# EAGLE schematic A3660 (EAGLE 8.2.2)

## Sheet 1 of 6
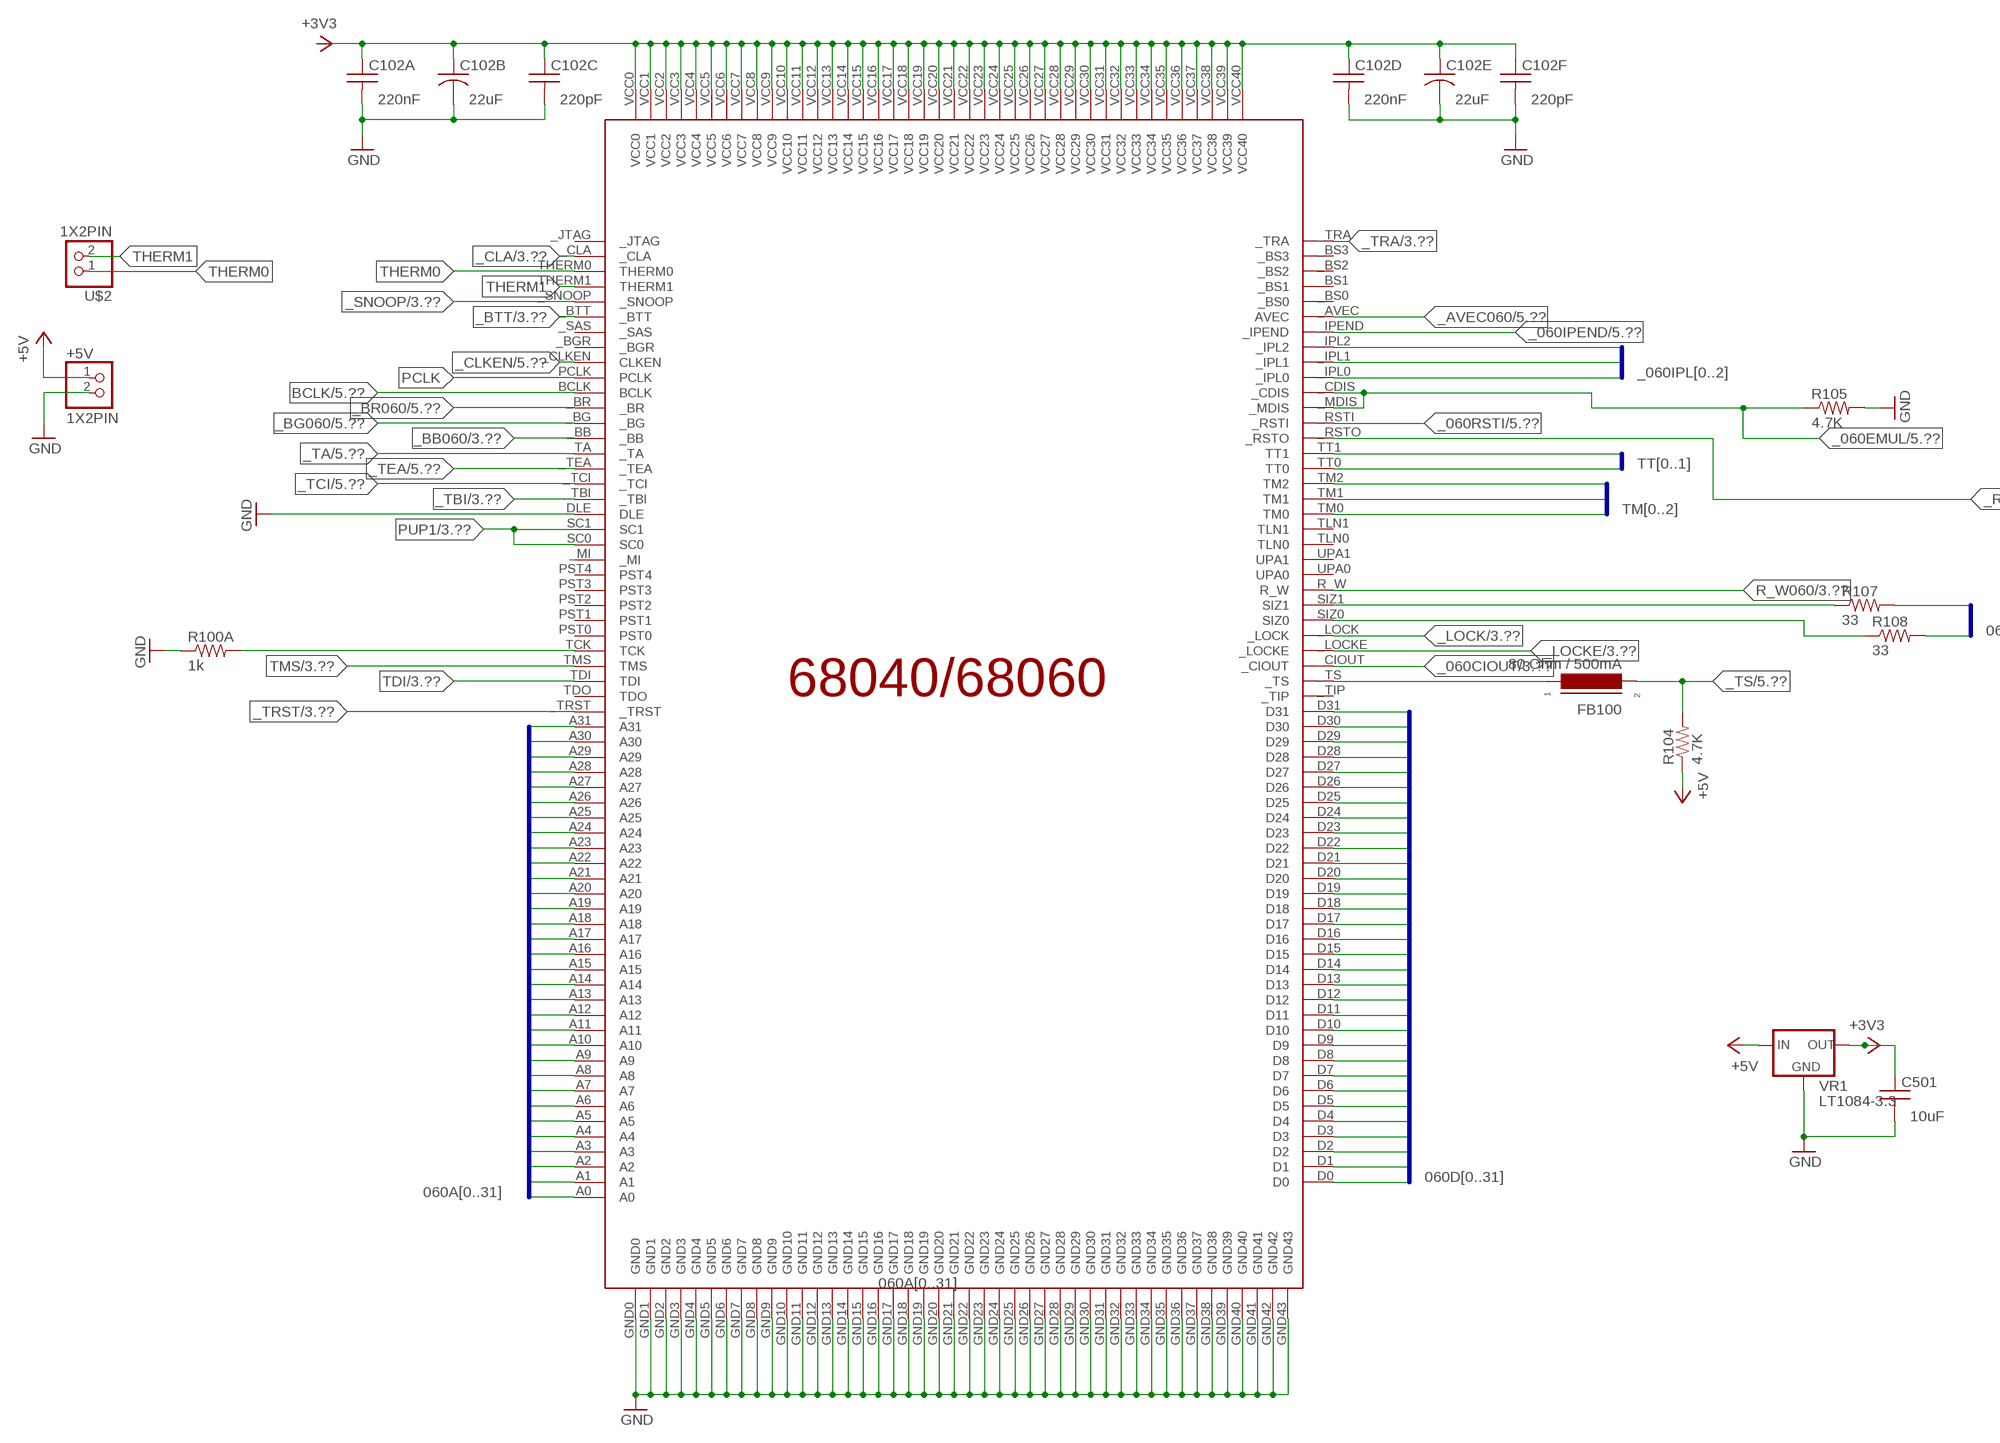
[diagram p0: schematic, sheet 1, part 1 of 2]
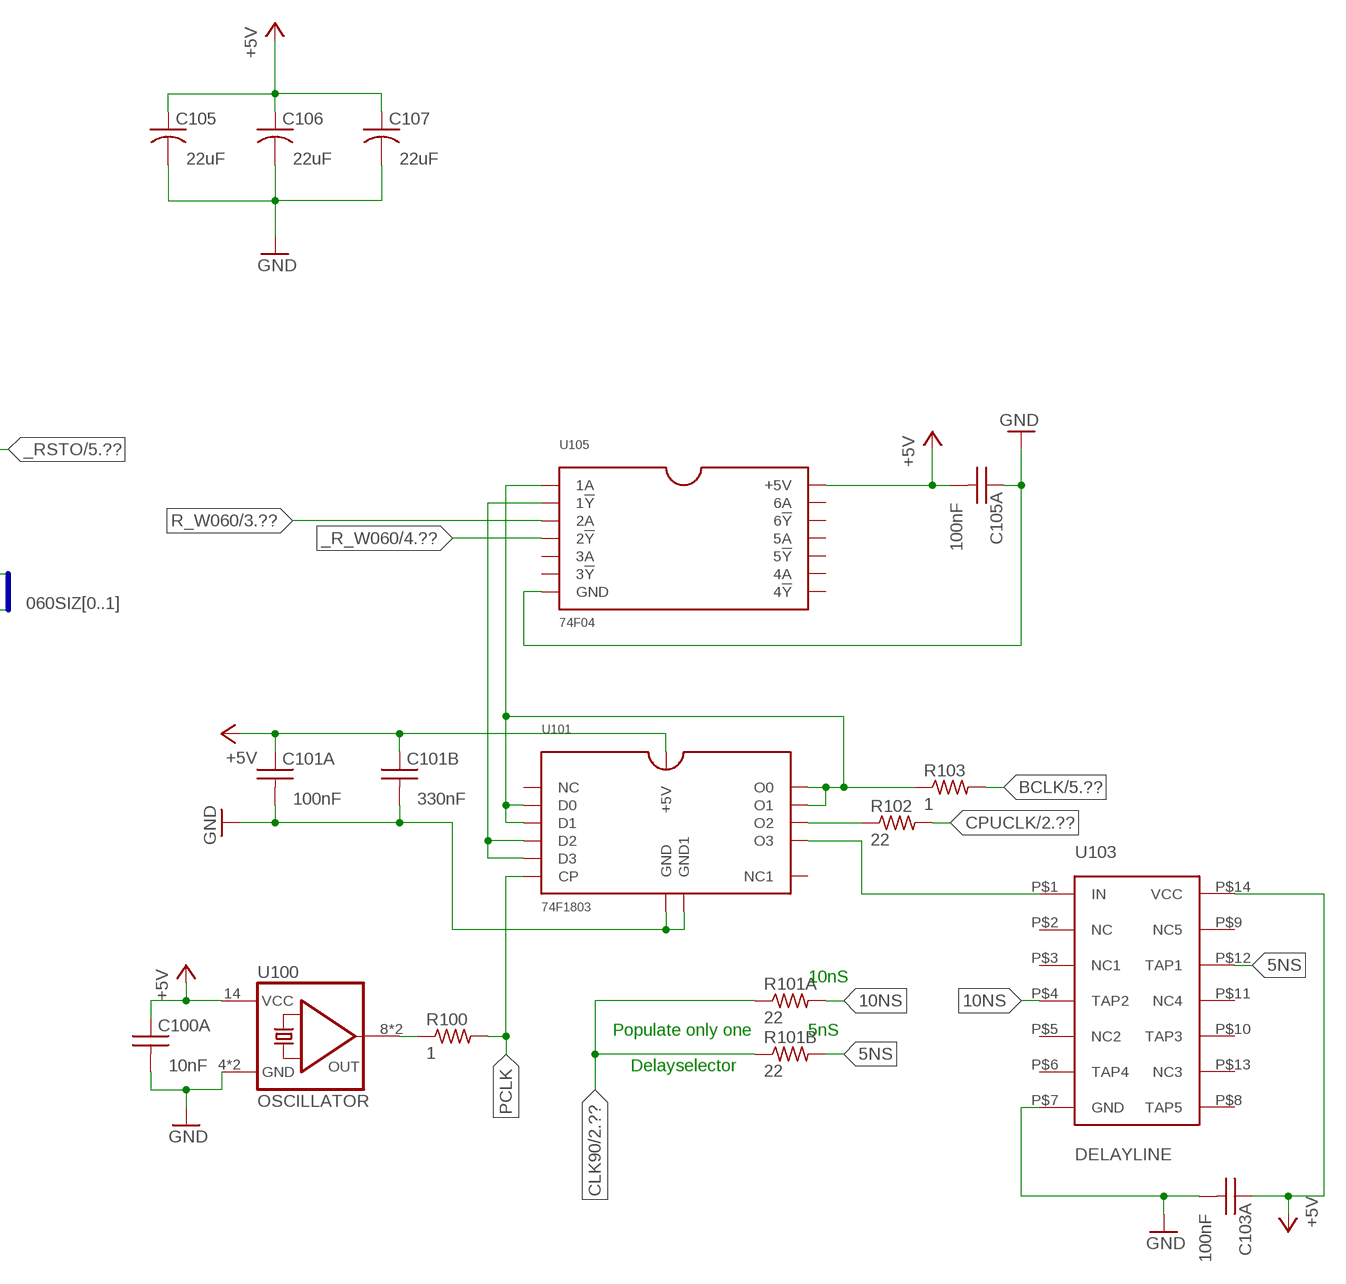
[diagram p1: schematic, sheet 1, part 2 of 2]

### Parts
+5V  1X2PIN  [1X2PIN]
C100A  10nF  C0805  [R0805]
C101A  100nF  C0805  [R0805]
C101B  330nF  C0805  [R0805]
C102A  220nF  C0805  [R0805]
C102B  22uF  SMD-ELECTROLYTE  [SMD-ELECTROLYTE]
C102C  220pF  C0805  [R0805]
C102D  220nF  C0805  [R0805]
C102E  22uF  SMD-ELECTROLYTE  [SMD-ELECTROLYTE]
C102F  220pF  C0805  [R0805]
C103A  100nF  C0805  [R0805]
C105  22uF  SMD-ELECTROLYTE  [SMD-ELECTROLYTE]
C105A  100nF  C0805  [R0805]
C106  22uF  SMD-ELECTROLYTE  [SMD-ELECTROLYTE]
C107  22uF  SMD-ELECTROLYTE  [SMD-ELECTROLYTE]
C501  10uF  C0805  [R0805]
FB100  80 Ohm / 500mA  FERRITE  [FERRITE]
R100  1  R0805  [R0805]
R100A  1k  R0805  [R0805]
R101A  22  R0805  [R0805]
R101B  22  R0805  [R0805]
R102  22  R0805  [R0805]
R103  1  R0805  [R0805]
R104  4.7K  R0805  [R0805]
R105  4.7K  R0805  [R0805]
R107  33  R0805  [R0805]
R108  33  R0805  [R0805]
U100  OSCILLATOR  [OSCILLATOR]
U101  74F1803  [74F1803]
U102  MC68040/68060  [MC68040/68060]
U103  DELAYLINE  [DELAYLINE]
U105  74F04  [74F04]
U$2  1X2PIN  [1X2PIN]
VR1  LT1084-3.3  [LT1084-3.3]

### Nets
5NS: R101B.2 U103.P$12(TAP1)
10NS: R101A.2 U103.P$4(TAP2)
060A0: U102.A0 ; also sheet 3
060A1: U102.A1 ; also sheet 3
060A2: U102.A2 ; also sheet 3
060A3: U102.A3 ; also sheet 3
060A4: U102.A4 ; also sheet 3
060A5: U102.A5 ; also sheet 3
060A6: U102.A6 ; also sheet 3
060A7: U102.A7 ; also sheet 3
060A8: U102.A8 ; also sheet 3
060A9: U102.A9 ; also sheet 3
060A10: U102.A10 ; also sheet 3
060A11: U102.A11 ; also sheet 3
060A12: U102.A12 ; also sheet 3
060A13: U102.A13 ; also sheet 3
060A14: U102.A14 ; also sheet 3
060A15: U102.A15 ; also sheet 3
060A16: U102.A16 ; also sheet 3
060A17: U102.A17 ; also sheet 3
060A18: U102.A18 ; also sheet 3
060A19: U102.A19 ; also sheet 3
060A20: U102.A20 ; also sheet 3
060A21: U102.A21 ; also sheet 3
060A22: U102.A22 ; also sheet 3
060A23: U102.A23 ; also sheet 3
060A24: U102.A24 ; also sheet 3
060A25: U102.A25 ; also sheet 3
060A26: U102.A26 ; also sheet 3
060A27: U102.A27 ; also sheet 3
060A28: U102.A28 ; also sheet 3
060A29: U102.A29 ; also sheet 3
060A30: U102.A30 ; also sheet 3
060A31: U102.A31 ; also sheet 3
060D0: U102.D0 ; also sheet 3,4
060D1: U102.D1 ; also sheet 3,4
060D2: U102.D2 ; also sheet 3,4
060D3: U102.D3 ; also sheet 3,4
060D4: U102.D4 ; also sheet 3,4
060D5: U102.D5 ; also sheet 3,4
060D6: U102.D6 ; also sheet 3,4
060D7: U102.D7 ; also sheet 3,4
060D8: U102.D8 ; also sheet 3,4
060D9: U102.D9 ; also sheet 3,4
060D10: U102.D10 ; also sheet 3,4
060D11: U102.D11 ; also sheet 3,4
060D12: U102.D12 ; also sheet 3,4
060D13: U102.D13 ; also sheet 3,4
060D14: U102.D14 ; also sheet 3,4
060D15: U102.D15 ; also sheet 3,4
060D16: U102.D16 ; also sheet 3,4
060D17: U102.D17 ; also sheet 3,4
060D18: U102.D18 ; also sheet 3,4
060D19: U102.D19 ; also sheet 3,4
060D20: U102.D20 ; also sheet 3,4
060D21: U102.D21 ; also sheet 3,4
060D22: U102.D22 ; also sheet 3,4
060D23: U102.D23 ; also sheet 3,4
060D24: U102.D24 ; also sheet 3,4
060D25: U102.D25 ; also sheet 3,4
060D26: U102.D26 ; also sheet 3,4
060D27: U102.D27 ; also sheet 3,4
060D28: U102.D28 ; also sheet 3,4
060D29: U102.D29 ; also sheet 3,4
060D30: U102.D30 ; also sheet 3,4
060D31: U102.D31 ; also sheet 3,4
060SIZ0: R108.2 ; also sheet 3,5
060SIZ1: R107.2 ; also sheet 3,5
+3V3: C102A.1 C102B.+ C102C.1 C102D.1 C102E.+ C102F.1 C501.1 U102.VCC0 U102.VCC1 U102.VCC2 U102.VCC3 U102.VCC4 U102.VCC5 U102.VCC6 U102.VCC7 U102.VCC8 U102.VCC9 U102.VCC10 U102.VCC11 U102.VCC12 U102.VCC13 U102.VCC14 U102.VCC15 U102.VCC16 U102.VCC17 U102.VCC18 U102.VCC19 U102.VCC20 U102.VCC21 U102.VCC22 U102.VCC23 U102.VCC24 U102.VCC25 U102.VCC26 U102.VCC27 U102.VCC28 U102.VCC29 U102.VCC30 U102.VCC31 U102.VCC32 U102.VCC33 U102.VCC34 U102.VCC35 U102.VCC36 U102.VCC37 U102.VCC38 U102.VCC39 U102.VCC40 VR1.OUT VR1.OUT2(OUT) ; also sheet 3,5
+5V: +5V.1 C100A.1 C101A.1 C101B.1 C103A.1 C105.+ C105A.2 C106.+ C107.+ R104.1 U100.14(+5V) U101.14(+5V) U103.P$14(VCC) U105.14(+5V) VR1.IN ; also sheet 2,3,4,5
_060CIOUT: U102._CIOUT ; also sheet 3,5
_060EMUL: R105.1 U102._CDIS U102._MDIS ; also sheet 5
_060IPEND: U102._IPEND ; also sheet 5
_060IPL0: U102._IPL0 ; also sheet 5
_060IPL1: U102._IPL1 ; also sheet 5
_060IPL2: U102._IPL2 ; also sheet 5
_060RSTI: U102._RSTI ; also sheet 5
_AVEC060: U102._AVEC(AVEC) ; also sheet 5
_BB060: U102._BB ; also sheet 3,5
_BG060: U102._BG ; also sheet 5
_BR060: U102._BR ; also sheet 5
_BTT: U102._BTT ; also sheet 3
_CLA: U102._CLA ; also sheet 3
_CLKEN: U102._CLKEN(CLKEN) ; also sheet 5
_LOCK: U102._LOCK ; also sheet 3,5
_LOCKE: U102._LOCKE ; also sheet 3,5
_R_W060: U105.4(2!Y) ; also sheet 4
_RSTO: U102._RSTO ; also sheet 5
_SNOOP: U102._SNOOP ; also sheet 3
_TA: U102._TA ; also sheet 5
_TBI: U102._TBI ; also sheet 3
_TCI: U102._TCI ; also sheet 5
_TEA: U102._TEA ; also sheet 5
_TRA: U102._TRA ; also sheet 3
_TRST: U102._TRST ; also sheet 3
_TS: FB100.2 R104.2 ; also sheet 5
BCLK: R103.2 U102.BCLK ; also sheet 5
CLK90: R101A.1 R101B.1 ; also sheet 2
CPUCLK: R102.2 ; also sheet 2
GND: +5V.2 C100A.2 C101A.2 C101B.2 C102A.2 C102B.- C102C.2 C102D.2 C102E.- C102F.2 C103A.2 C105.- C105A.1 C106.- C107.- C501.2 R100A.1 R105.2 U100.4(GND) U100.7(GND) U101.1(GND) U101.7(GND1) U102.DLE U102.GND0 U102.GND1 U102.GND2 U102.GND3 U102.GND4 U102.GND5 U102.GND6 U102.GND7 U102.GND8 U102.GND9 U102.GND10 U102.GND11 U102.GND12 U102.GND13 U102.GND14 U102.GND15 U102.GND16 U102.GND17 U102.GND18 U102.GND19 U102.GND20 U102.GND21 U102.GND22 U102.GND23 U102.GND24 U102.GND25 U102.GND26 U102.GND27 U102.GND28 U102.GND29 U102.GND30 U102.GND31 U102.GND32 U102.GND33 U102.GND34 U102.GND35 U102.GND36 U102.GND37 U102.GND38 U102.GND39 U102.GND40 U102.GND41 U102.GND42 U102.GND43 U103.P$7(GND) U105.7(GND) VR1.GND ; also sheet 2,3,4,5
N$2: R107.1 U102.SIZ1
N$3: R108.1 U102.SIZ0
N$4: FB100.1 U102._TS
N$6: R100.1 U100.8(OUT) U100.11(OUT)
N$11: U101.10(D2) U101.11(D3) U105.2(1!Y)
N$12: R103.1 U101.3(O0) U101.4(D0) U101.5(D1) U101.6(O1) U105.1(1A)
N$13: R102.1 U101.9(O2)
N$14: U101.12(O3) U103.P$1(IN)
PCLK: R100.2 U101.8(CP) U102.PCLK
PUP1: U102.SC0 U102.SC1 ; also sheet 3
R_W060: U102.R_W U105.3(2A) ; also sheet 3,4,5
TCK: R100A.2 U102.TCK
TDI: U102.TDI ; also sheet 3
THERM0: U102.THERM0 U$2.1
THERM1: U102.THERM1 U$2.2
TM0: U102.TM0 ; also sheet 3,5
TM1: U102.TM1 ; also sheet 3,5
TM2: U102.TM2 ; also sheet 3,5
TMS: U102.TMS ; also sheet 3
TT0: U102.TT0 ; also sheet 3,5
TT1: U102.TT1 ; also sheet 3,5
Unconnected: U101.2(NC) U101.13(NC1) U102._BGR U102._BS0 U102._BS1 U102._BS2 U102._BS3 U102._JTAG U102._MI U102._SAS U102._TIP U102.PST0 U102.PST1 U102.PST2 U102.PST3 U102.PST4 U102.TDO U102.TLN0 U102.TLN1 U102.UPA0 U102.UPA1 U103.P$2(NC) U103.P$3(NC1) U103.P$5(NC2) U103.P$6(TAP4) U103.P$8(TAP5) U103.P$9(NC5) U103.P$10(TAP3) U103.P$11(NC4) U103.P$13(NC3) U105.5(3A) U105.6(3!Y) U105.8(4!Y) U105.9(4A) U105.10(5!Y) U105.11(5A) U105.12(6!Y) U105.13(6A)

### Buses
060D[0..31]
_060IPL[0..2]
TT[0..1]
TM[0..2]
060SIZ[0..1]
060A[0..31]

### Notes on the sheet
- 10nS
- Populate only one | 5nS
- Delayselector

## Sheet 2 of 6: 32 Bit Local Slot
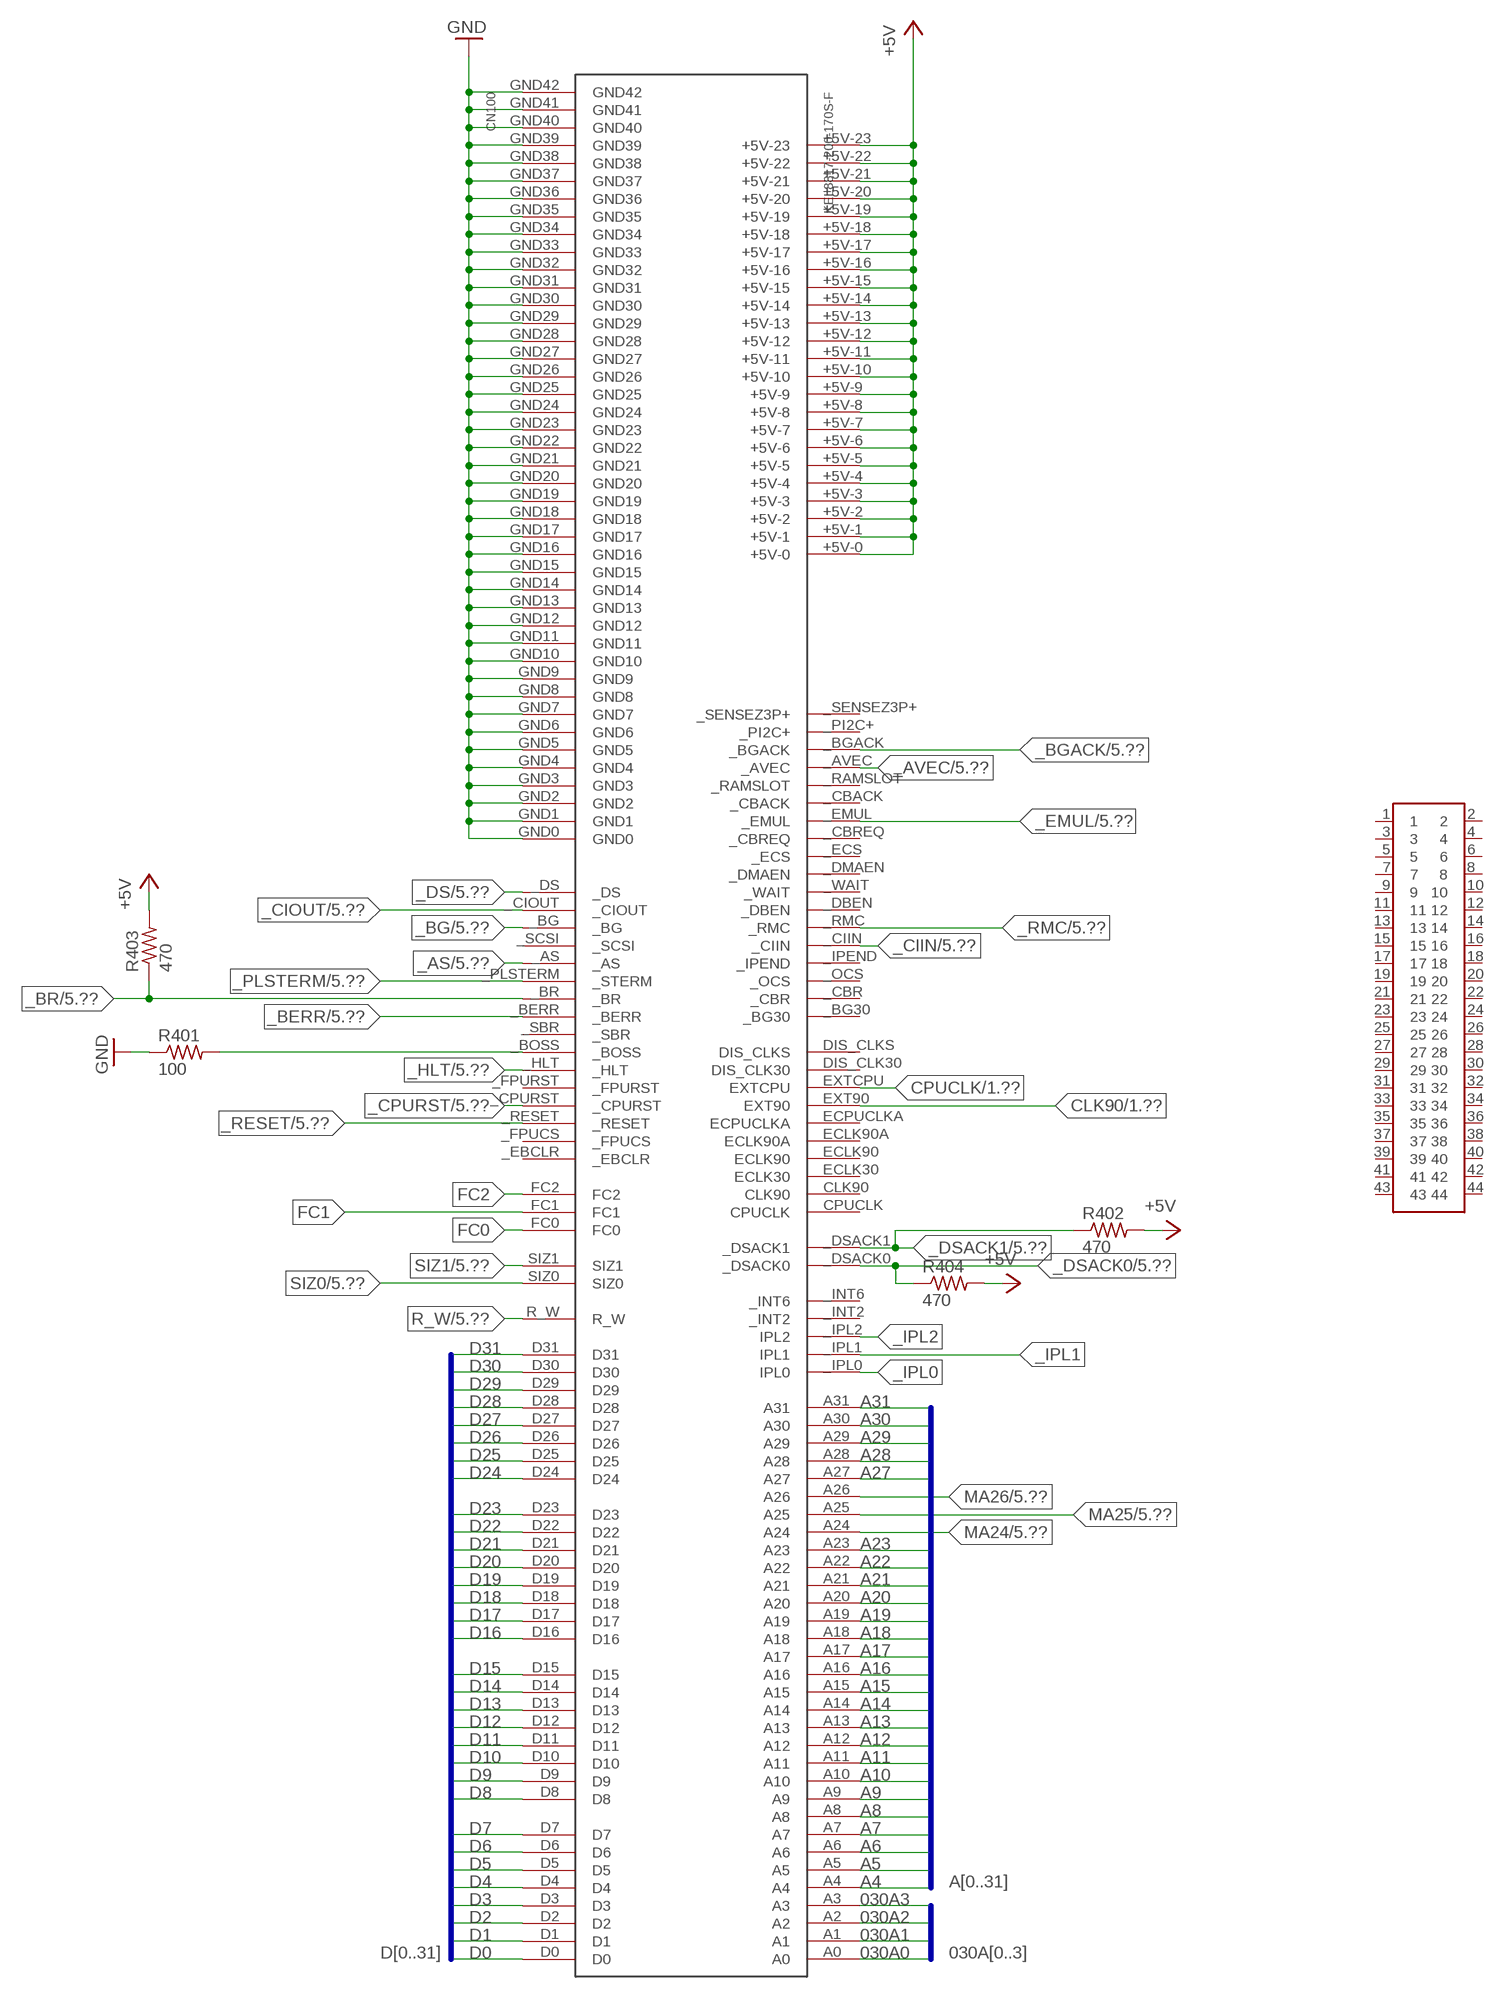
[diagram p2: schematic, sheet 2]

### Parts
CN100  KEL8817-200-170S-F  [KEL8817-200-170S-F]
R401  100  R0805  [R0805]
R402  470  R0805  [R0805]
R403  470  R0805  [R0805]
R404  470  R0805  [R0805]
U$1  2X22-2MM  [2X22]

### Nets
030A0: CN100.A0 ; also sheet 5
030A1: CN100.A1 ; also sheet 5
030A2: CN100.A2 ; also sheet 5
030A3: CN100.A3 ; also sheet 5
+5V: CN100.+5V-0 CN100.+5V-1 CN100.+5V-2 CN100.+5V-3 CN100.+5V-4 CN100.+5V-5 CN100.+5V-6 CN100.+5V-7 CN100.+5V-8 CN100.+5V-9 CN100.+5V-10 CN100.+5V-11 CN100.+5V-12 CN100.+5V-13 CN100.+5V-14 CN100.+5V-15 CN100.+5V-16 CN100.+5V-17 CN100.+5V-18 CN100.+5V-19 CN100.+5V-20 CN100.+5V-21 CN100.+5V-22 CN100.+5V-23 R402.2 R403.2 R404.2 ; also sheet 1,3,4,5
_AS: CN100._AS ; also sheet 5
_AVEC: CN100._AVEC ; also sheet 5
_BERR: CN100._BERR ; also sheet 5
_BG: CN100._BG ; also sheet 5
_BGACK: CN100._BGACK ; also sheet 5
_BR: CN100._BR R403.1 ; also sheet 5
_CIIN: CN100._CIIN ; also sheet 5
_CIOUT: CN100._CIOUT ; also sheet 5
_CPURST: CN100._CPURST ; also sheet 5
_DS: CN100._DS ; also sheet 5
_DSACK0: CN100._DSACK0 R404.1 ; also sheet 5
_DSACK1: CN100._DSACK1 R402.1 ; also sheet 5
_EMUL: CN100._EMUL ; also sheet 5
_HLT: CN100._HLT ; also sheet 5
_IPL0: CN100._IPL0(IPL0) ; also sheet 5
_IPL1: CN100._IPL1(IPL1) ; also sheet 5
_IPL2: CN100._IPL2(IPL2) ; also sheet 5
_PLSTERM: CN100._PLSTERM(_STERM) ; also sheet 5
_RESET: CN100._RESET ; also sheet 5
_RMC: CN100._RMC ; also sheet 5
A4: CN100.A4 ; also sheet 3
A5: CN100.A5 ; also sheet 3
A6: CN100.A6 ; also sheet 3
A7: CN100.A7 ; also sheet 3
A8: CN100.A8 ; also sheet 3
A9: CN100.A9 ; also sheet 3
A10: CN100.A10 ; also sheet 3
A11: CN100.A11 ; also sheet 3
A12: CN100.A12 ; also sheet 3
A13: CN100.A13 ; also sheet 3
A14: CN100.A14 ; also sheet 3
A15: CN100.A15 ; also sheet 3
A16: CN100.A16 ; also sheet 3
A17: CN100.A17 ; also sheet 3
A18: CN100.A18 ; also sheet 3
A19: CN100.A19 ; also sheet 3,5
A20: CN100.A20 ; also sheet 3,5
A21: CN100.A21 ; also sheet 3,5
A22: CN100.A22 ; also sheet 3,5
A23: CN100.A23 ; also sheet 3,5
A27: CN100.A27 ; also sheet 3,5
A28: CN100.A28 ; also sheet 3,5
A29: CN100.A29 ; also sheet 3,5
A30: CN100.A30 ; also sheet 3,5
A31: CN100.A31 ; also sheet 3,5
CLK90: CN100.EXT90 ; also sheet 1
CPUCLK: CN100.EXTCPU ; also sheet 1
D0: CN100.D0 ; also sheet 4
D1: CN100.D1 ; also sheet 4
D2: CN100.D2 ; also sheet 4
D3: CN100.D3 ; also sheet 4
D4: CN100.D4 ; also sheet 4
D5: CN100.D5 ; also sheet 4
D6: CN100.D6 ; also sheet 4
D7: CN100.D7 ; also sheet 4
D8: CN100.D8 ; also sheet 4
D9: CN100.D9 ; also sheet 4
D10: CN100.D10 ; also sheet 4
D11: CN100.D11 ; also sheet 4
D12: CN100.D12 ; also sheet 4
D13: CN100.D13 ; also sheet 4
D14: CN100.D14 ; also sheet 4
D15: CN100.D15 ; also sheet 4
D16: CN100.D16 ; also sheet 4
D17: CN100.D17 ; also sheet 4
D18: CN100.D18 ; also sheet 4
D19: CN100.D19 ; also sheet 4
D20: CN100.D20 ; also sheet 4
D21: CN100.D21 ; also sheet 4
D22: CN100.D22 ; also sheet 4
D23: CN100.D23 ; also sheet 4
D24: CN100.D24 ; also sheet 4
D25: CN100.D25 ; also sheet 4
D26: CN100.D26 ; also sheet 4
D27: CN100.D27 ; also sheet 4
D28: CN100.D28 ; also sheet 4
D29: CN100.D29 ; also sheet 4
D30: CN100.D30 ; also sheet 4
D31: CN100.D31 ; also sheet 4
FC0: CN100.FC0 ; also sheet 5
FC1: CN100.FC1 ; also sheet 5
FC2: CN100.FC2 ; also sheet 5
GND: CN100.GND0 CN100.GND1 CN100.GND2 CN100.GND3 CN100.GND4 CN100.GND5 CN100.GND6 CN100.GND7 CN100.GND8 CN100.GND9 CN100.GND10 CN100.GND11 CN100.GND12 CN100.GND13 CN100.GND14 CN100.GND15 CN100.GND16 CN100.GND17 CN100.GND18 CN100.GND19 CN100.GND20 CN100.GND21 CN100.GND22 CN100.GND23 CN100.GND24 CN100.GND25 CN100.GND26 CN100.GND27 CN100.GND28 CN100.GND29 CN100.GND30 CN100.GND31 CN100.GND32 CN100.GND33 CN100.GND34 CN100.GND35 CN100.GND36 CN100.GND37 CN100.GND38 CN100.GND39 CN100.GND40 CN100.GND41 CN100.GND42 R401.1 ; also sheet 1,3,4,5
MA24: CN100.A24 ; also sheet 5
MA25: CN100.A25 ; also sheet 5
MA26: CN100.A26 ; also sheet 5
N$16: CN100._BOSS R401.2
R_W: CN100.R_W ; also sheet 5
SIZ0: CN100.SIZ0 ; also sheet 5
SIZ1: CN100.SIZ1 ; also sheet 5
Unconnected: CN100._BG30 CN100._CBACK CN100._CBR CN100._CBREQ CN100._DBEN CN100._DMAEN CN100._EBCLR CN100._ECS CN100._FPUCS CN100._FPURST CN100._INT2 CN100._INT6 CN100._IPEND CN100._OCS CN100._PI2C+ CN100._RAMSLOT CN100._SBR CN100._SCSI CN100._SENSEZ3P+ CN100._WAIT CN100.CLK90 CN100.CPUCLK CN100.DIS_CLK30 CN100.DIS_CLKS CN100.ECLK30 CN100.ECLK90 CN100.ECLK90A CN100.ECPUCLKA U$1.1 U$1.2 U$1.3 U$1.4 U$1.5 U$1.6 U$1.7 U$1.8 U$1.9 U$1.10 U$1.11 U$1.12 U$1.13 U$1.14 U$1.15 U$1.16 U$1.17 U$1.18 U$1.19 U$1.20 U$1.21 U$1.22 U$1.23 U$1.24 U$1.25 U$1.26 U$1.27 U$1.28 U$1.29 U$1.30 U$1.31 U$1.32 U$1.33 U$1.34 U$1.35 U$1.36 U$1.37 U$1.38 U$1.39 U$1.40 U$1.41 U$1.42 U$1.43 U$1.44

### Buses
D[0..31]
A[0..31]
030A[0..3]

## Sheet 3 of 6: Resistorpacks
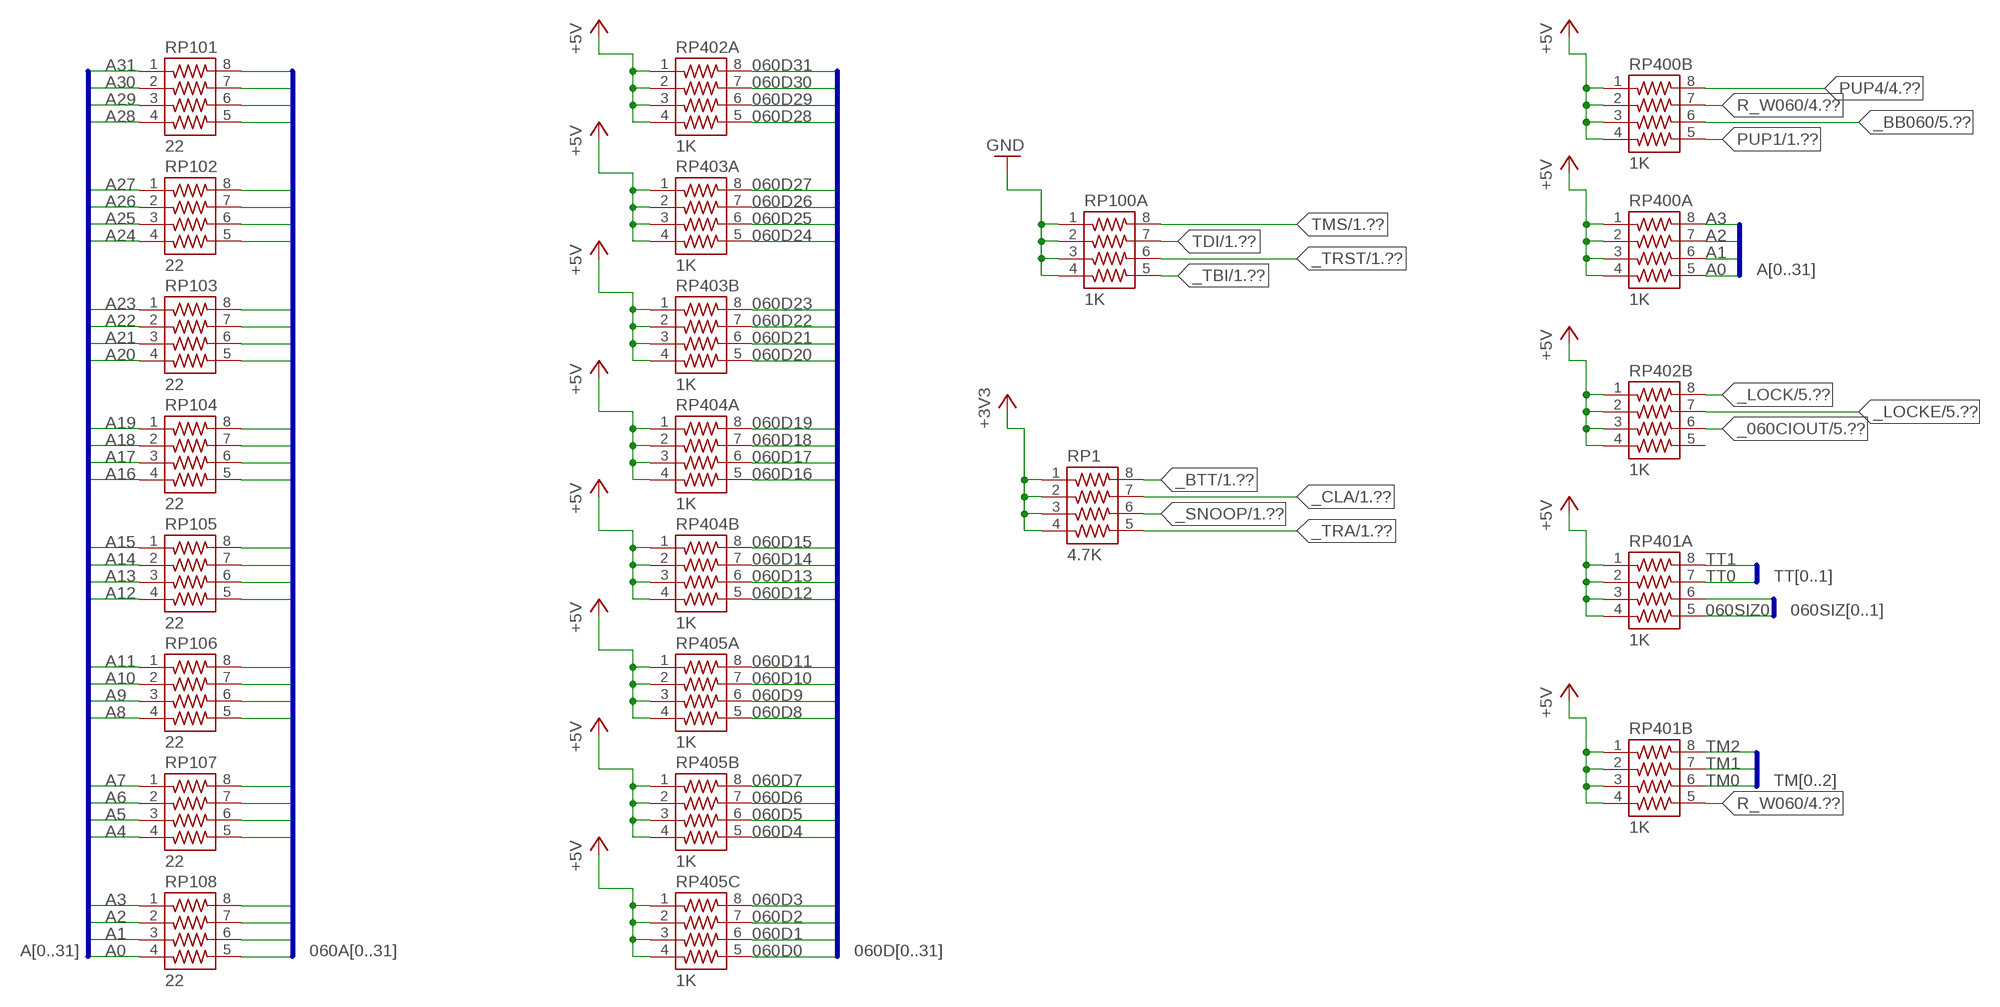
[diagram p3: schematic, sheet 3]

### Parts
RP1  4.7K  RP743-8  [RP743-8]
RP100A  1K  RP743-8  [RP743-8]
RP101  22  RP743-8  [RP743-8]
RP102  22  RP743-8  [RP743-8]
RP103  22  RP743-8  [RP743-8]
RP104  22  RP743-8  [RP743-8]
RP105  22  RP743-8  [RP743-8]
RP106  22  RP743-8  [RP743-8]
RP107  22  RP743-8  [RP743-8]
RP108  22  RP743-8  [RP743-8]
RP400A  1K  RP743-8  [RP743-8]
RP400B  1K  RP743-8  [RP743-8]
RP401A  1K  RP743-8  [RP743-8]
RP401B  1K  RP743-8  [RP743-8]
RP402A  1K  RP743-8  [RP743-8]
RP402B  1K  RP743-8  [RP743-8]
RP403A  1K  RP743-8  [RP743-8]
RP403B  1K  RP743-8  [RP743-8]
RP404A  1K  RP743-8  [RP743-8]
RP404B  1K  RP743-8  [RP743-8]
RP405A  1K  RP743-8  [RP743-8]
RP405B  1K  RP743-8  [RP743-8]
RP405C  1K  RP743-8  [RP743-8]

### Nets
060A0: RP108.5 ; also sheet 1
060A1: RP108.6 ; also sheet 1
060A2: RP108.7 ; also sheet 1
060A3: RP108.8 ; also sheet 1
060A4: RP107.5 ; also sheet 1
060A5: RP107.6 ; also sheet 1
060A6: RP107.7 ; also sheet 1
060A7: RP107.8 ; also sheet 1
060A8: RP106.5 ; also sheet 1
060A9: RP106.6 ; also sheet 1
060A10: RP106.7 ; also sheet 1
060A11: RP106.8 ; also sheet 1
060A12: RP105.5 ; also sheet 1
060A13: RP105.6 ; also sheet 1
060A14: RP105.7 ; also sheet 1
060A15: RP105.8 ; also sheet 1
060A16: RP104.5 ; also sheet 1
060A17: RP104.6 ; also sheet 1
060A18: RP104.7 ; also sheet 1
060A19: RP104.8 ; also sheet 1
060A20: RP103.5 ; also sheet 1
060A21: RP103.6 ; also sheet 1
060A22: RP103.7 ; also sheet 1
060A23: RP103.8 ; also sheet 1
060A24: RP102.5 ; also sheet 1
060A25: RP102.6 ; also sheet 1
060A26: RP102.7 ; also sheet 1
060A27: RP102.8 ; also sheet 1
060A28: RP101.5 ; also sheet 1
060A29: RP101.6 ; also sheet 1
060A30: RP101.7 ; also sheet 1
060A31: RP101.8 ; also sheet 1
060D0: RP405C.5 ; also sheet 1,4
060D1: RP405C.6 ; also sheet 1,4
060D2: RP405C.7 ; also sheet 1,4
060D3: RP405C.8 ; also sheet 1,4
060D4: RP405B.5 ; also sheet 1,4
060D5: RP405B.6 ; also sheet 1,4
060D6: RP405B.7 ; also sheet 1,4
060D7: RP405B.8 ; also sheet 1,4
060D8: RP405A.5 ; also sheet 1,4
060D9: RP405A.6 ; also sheet 1,4
060D10: RP405A.7 ; also sheet 1,4
060D11: RP405A.8 ; also sheet 1,4
060D12: RP404B.5 ; also sheet 1,4
060D13: RP404B.6 ; also sheet 1,4
060D14: RP404B.7 ; also sheet 1,4
060D15: RP404B.8 ; also sheet 1,4
060D16: RP404A.5 ; also sheet 1,4
060D17: RP404A.6 ; also sheet 1,4
060D18: RP404A.7 ; also sheet 1,4
060D19: RP404A.8 ; also sheet 1,4
060D20: RP403B.5 ; also sheet 1,4
060D21: RP403B.6 ; also sheet 1,4
060D22: RP403B.7 ; also sheet 1,4
060D23: RP403B.8 ; also sheet 1,4
060D24: RP403A.5 ; also sheet 1,4
060D25: RP403A.6 ; also sheet 1,4
060D26: RP403A.7 ; also sheet 1,4
060D27: RP403A.8 ; also sheet 1,4
060D28: RP402A.5 ; also sheet 1,4
060D29: RP402A.6 ; also sheet 1,4
060D30: RP402A.7 ; also sheet 1,4
060D31: RP402A.8 ; also sheet 1,4
060SIZ0: RP401A.5 ; also sheet 1,5
060SIZ1: RP401A.6 ; also sheet 1,5
+3V3: RP1.1 RP1.2 RP1.3 RP1.4 ; also sheet 1,5
+5V: RP400A.1 RP400A.2 RP400A.3 RP400A.4 RP400B.1 RP400B.2 RP400B.3 RP400B.4 RP401A.1 RP401A.2 RP401A.3 RP401A.4 RP401B.1 RP401B.2 RP401B.3 RP401B.4 RP402A.1 RP402A.2 RP402A.3 RP402A.4 RP402B.1 RP402B.2 RP402B.3 RP402B.4 RP403A.1 RP403A.2 RP403A.3 RP403A.4 RP403B.1 RP403B.2 RP403B.3 RP403B.4 RP404A.1 RP404A.2 RP404A.3 RP404A.4 RP404B.1 RP404B.2 RP404B.3 RP404B.4 RP405A.1 RP405A.2 RP405A.3 RP405A.4 RP405B.1 RP405B.2 RP405B.3 RP405B.4 RP405C.1 RP405C.2 RP405C.3 RP405C.4 ; also sheet 1,2,4,5
_060CIOUT: RP402B.6 ; also sheet 1,5
_BB060: RP400B.6 ; also sheet 1,5
_BTT: RP1.8 ; also sheet 1
_CLA: RP1.7 ; also sheet 1
_LOCK: RP402B.8 ; also sheet 1,5
_LOCKE: RP402B.7 ; also sheet 1,5
_SNOOP: RP1.6 ; also sheet 1
_TBI: RP100A.5 ; also sheet 1
_TRA: RP1.5 ; also sheet 1
_TRST: RP100A.6 ; also sheet 1
A0: RP108.4 RP400A.5 ; also sheet 5
A1: RP108.3 RP400A.6 ; also sheet 5
A2: RP108.2 RP400A.7 ; also sheet 5
A3: RP108.1 RP400A.8 ; also sheet 5
A4: RP107.4 ; also sheet 2
A5: RP107.3 ; also sheet 2
A6: RP107.2 ; also sheet 2
A7: RP107.1 ; also sheet 2
A8: RP106.4 ; also sheet 2
A9: RP106.3 ; also sheet 2
A10: RP106.2 ; also sheet 2
A11: RP106.1 ; also sheet 2
A12: RP105.4 ; also sheet 2
A13: RP105.3 ; also sheet 2
A14: RP105.2 ; also sheet 2
A15: RP105.1 ; also sheet 2
A16: RP104.4 ; also sheet 2
A17: RP104.3 ; also sheet 2
A18: RP104.2 ; also sheet 2
A19: RP104.1 ; also sheet 2,5
A20: RP103.4 ; also sheet 2,5
A21: RP103.3 ; also sheet 2,5
A22: RP103.2 ; also sheet 2,5
A23: RP103.1 ; also sheet 2,5
A24: RP102.4 ; also sheet 5
A25: RP102.3 ; also sheet 5
A26: RP102.2 ; also sheet 5
A27: RP102.1 ; also sheet 2,5
A28: RP101.4 ; also sheet 2,5
A29: RP101.3 ; also sheet 2,5
A30: RP101.2 ; also sheet 2,5
A31: RP101.1 ; also sheet 2,5
GND: RP100A.1 RP100A.2 RP100A.3 RP100A.4 ; also sheet 1,2,4,5
PUP1: RP400B.5 ; also sheet 1
PUP4: RP400B.8 ; also sheet 4
R_W060: RP400B.7 RP401B.5 ; also sheet 1,4,5
TDI: RP100A.7 ; also sheet 1
TM0: RP401B.6 ; also sheet 1,5
TM1: RP401B.7 ; also sheet 1,5
TM2: RP401B.8 ; also sheet 1,5
TMS: RP100A.8 ; also sheet 1
TT0: RP401A.7 ; also sheet 1,5
TT1: RP401A.8 ; also sheet 1,5
Unconnected: RP402B.5

### Buses
060A[0..31]
A[0..31]
060D[0..31]
TT[0..1]
TM[0..2]
060SIZ[0..1]

## Sheet 4 of 6: Latches
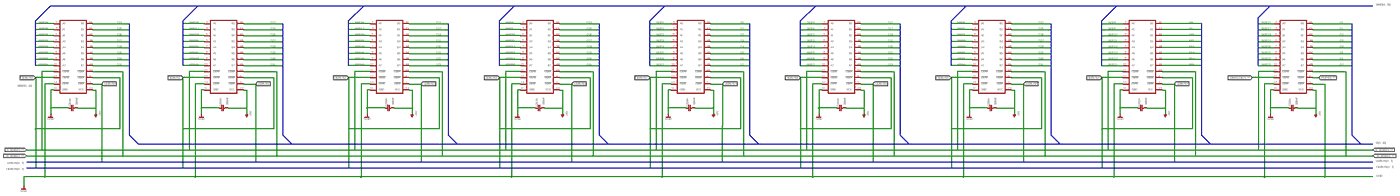
[diagram p4: schematic, sheet 4, overview]
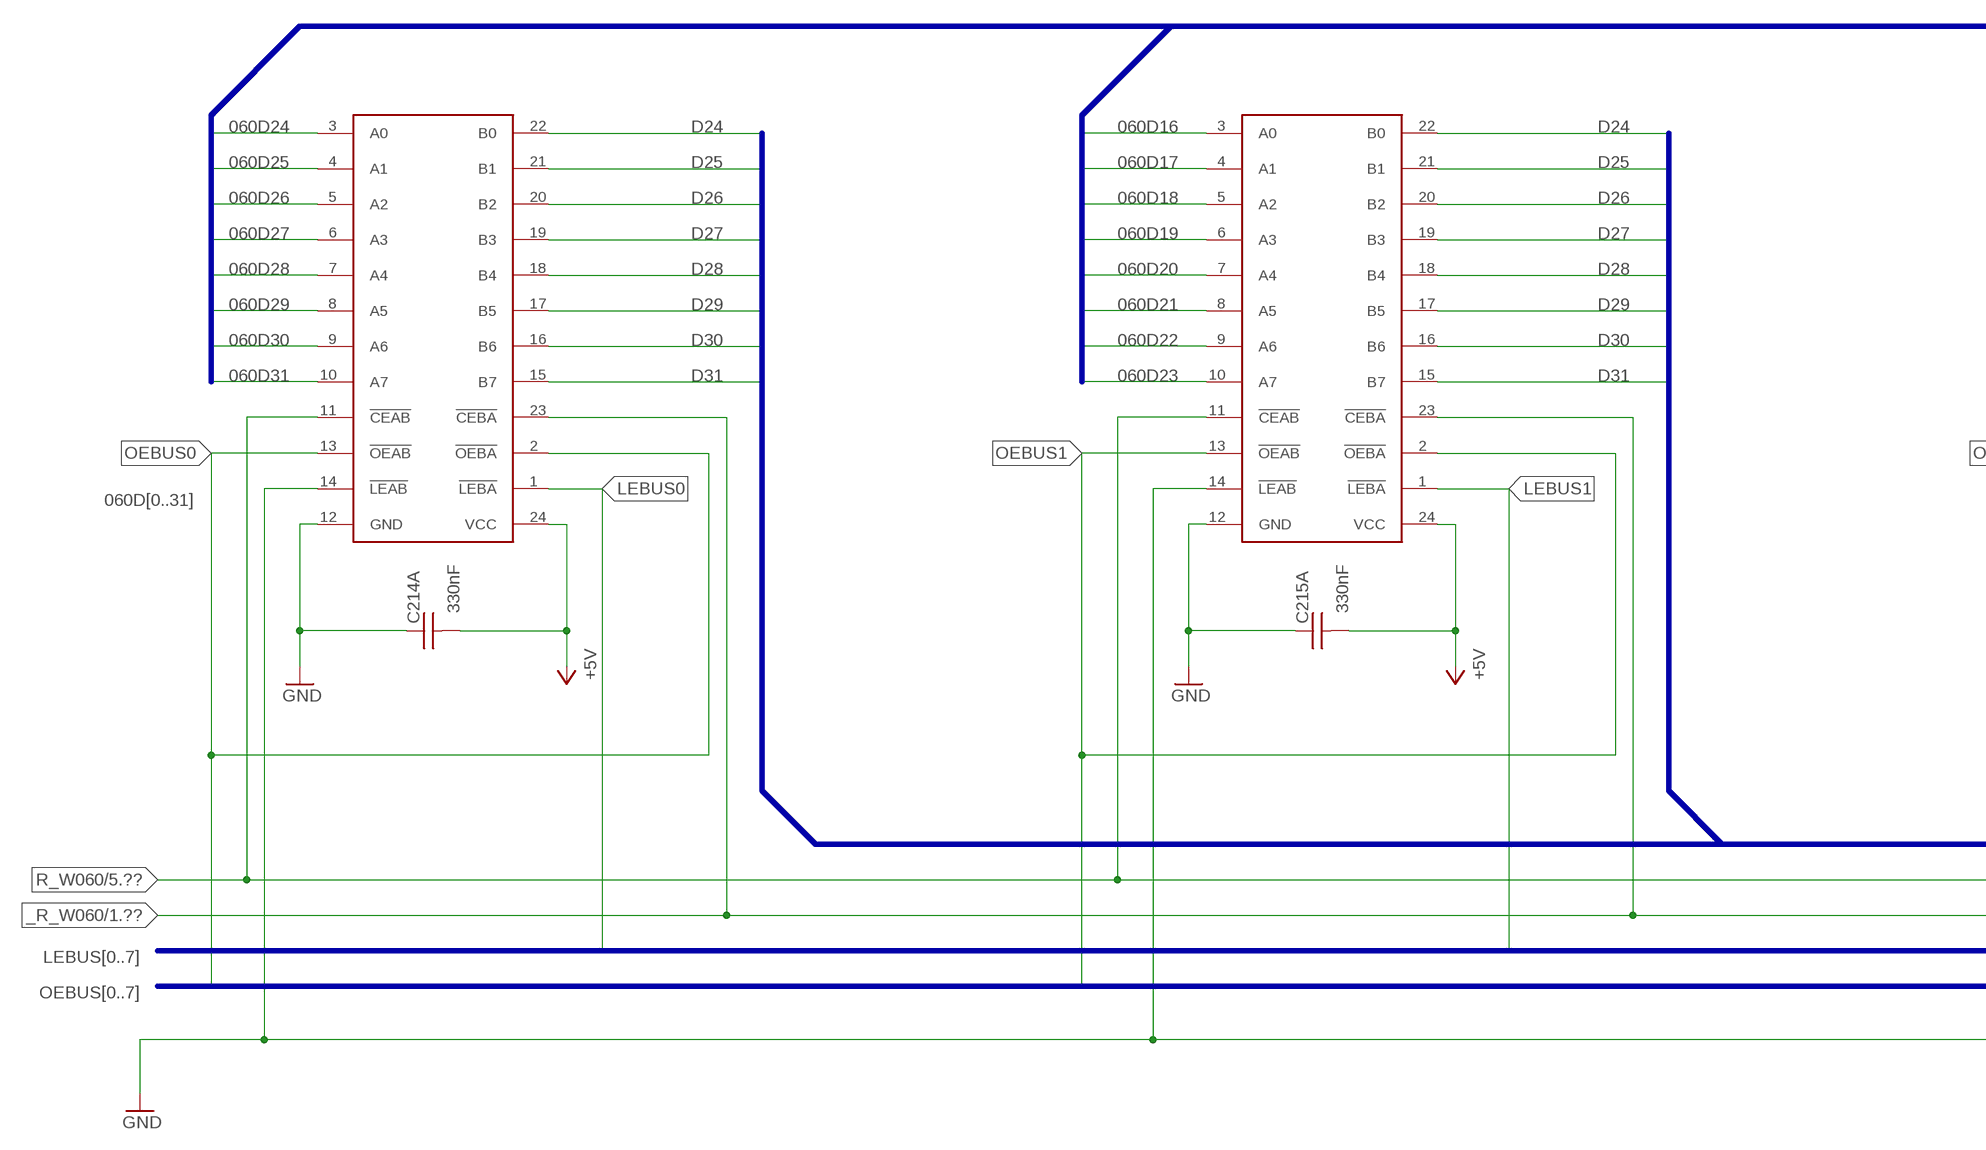
[diagram p5: schematic, sheet 4, part 1 of 4]
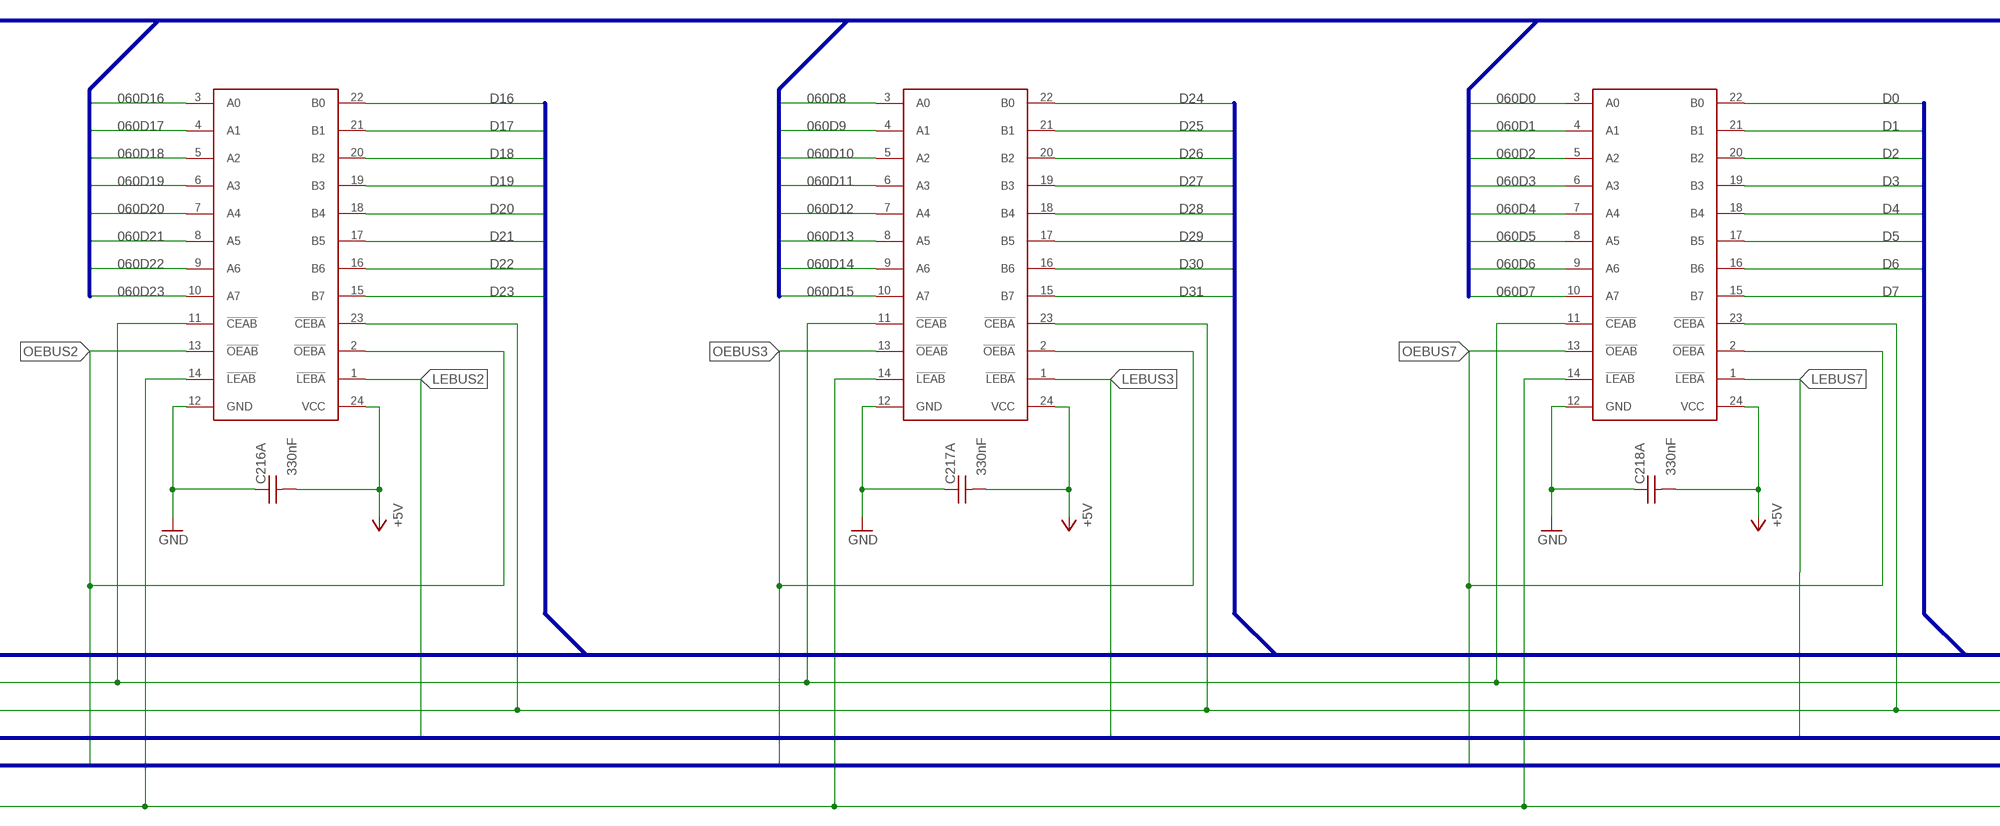
[diagram p6: schematic, sheet 4, part 2 of 4]
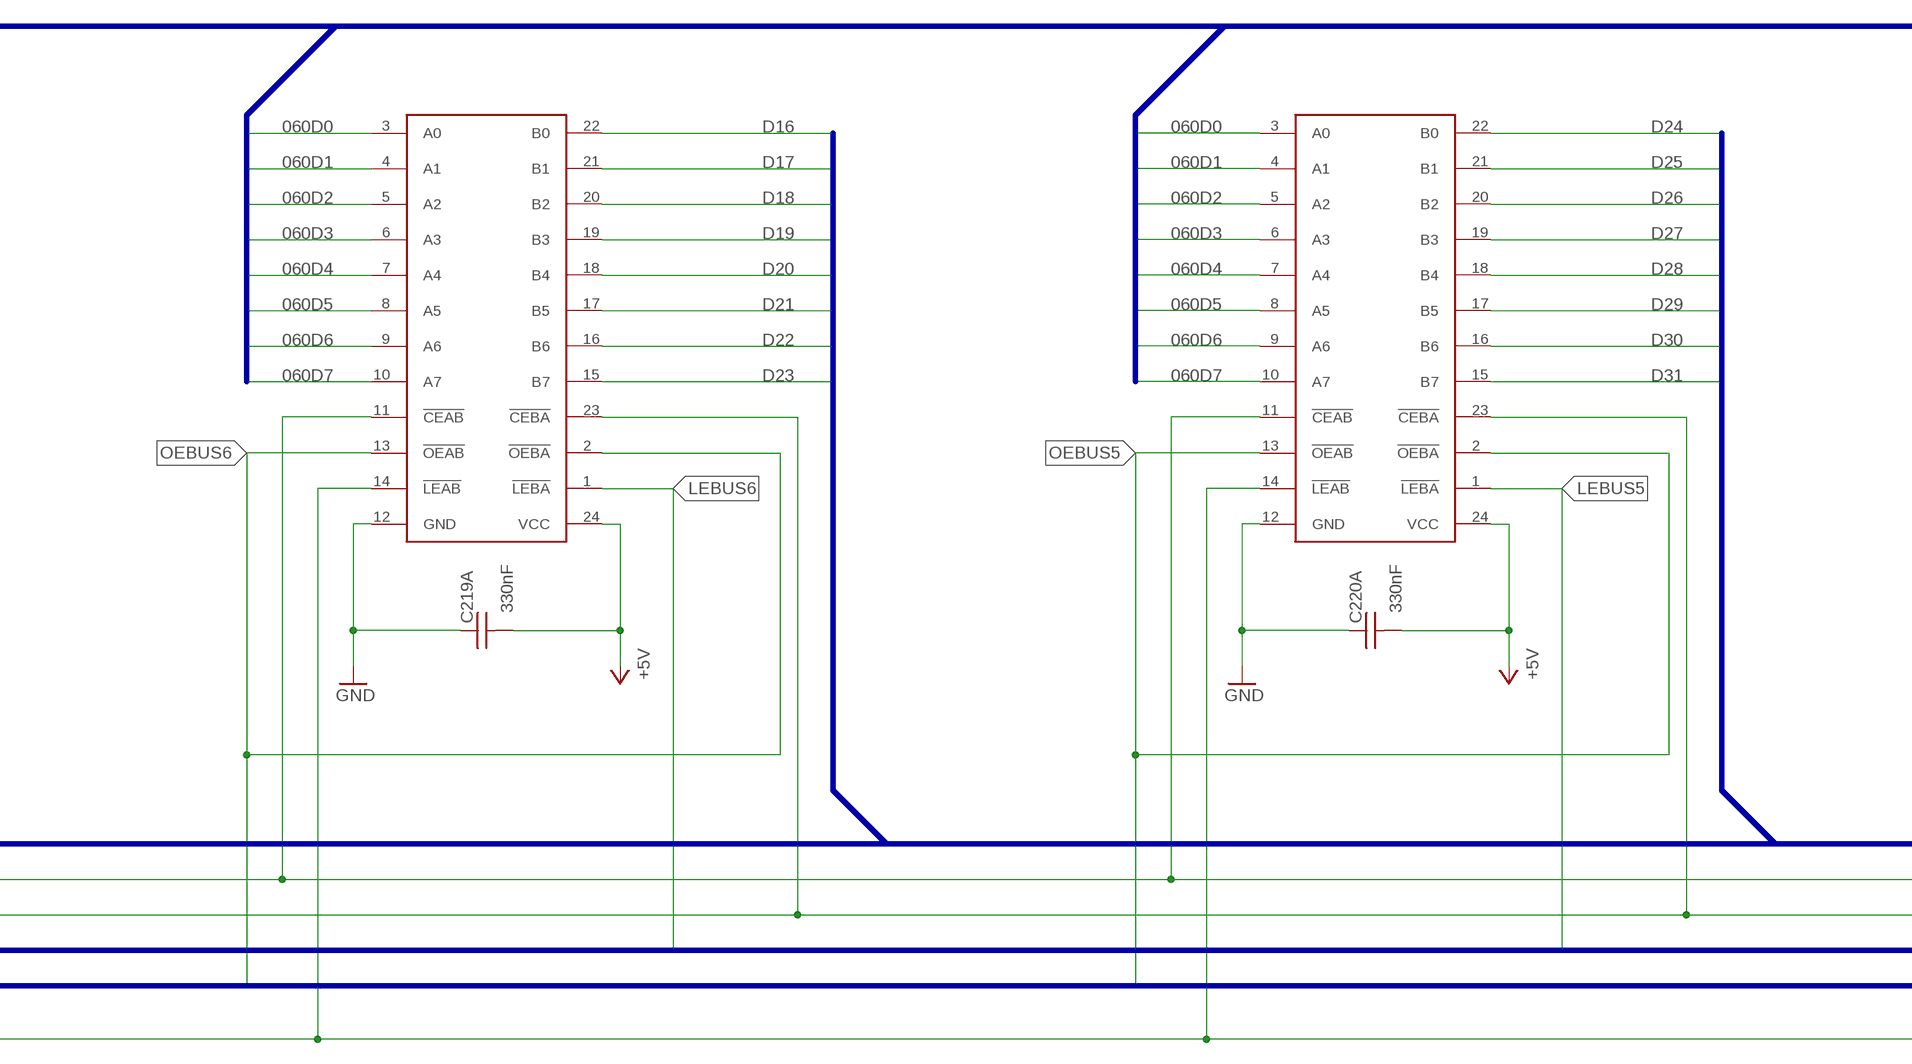
[diagram p7: schematic, sheet 4, part 3 of 4]
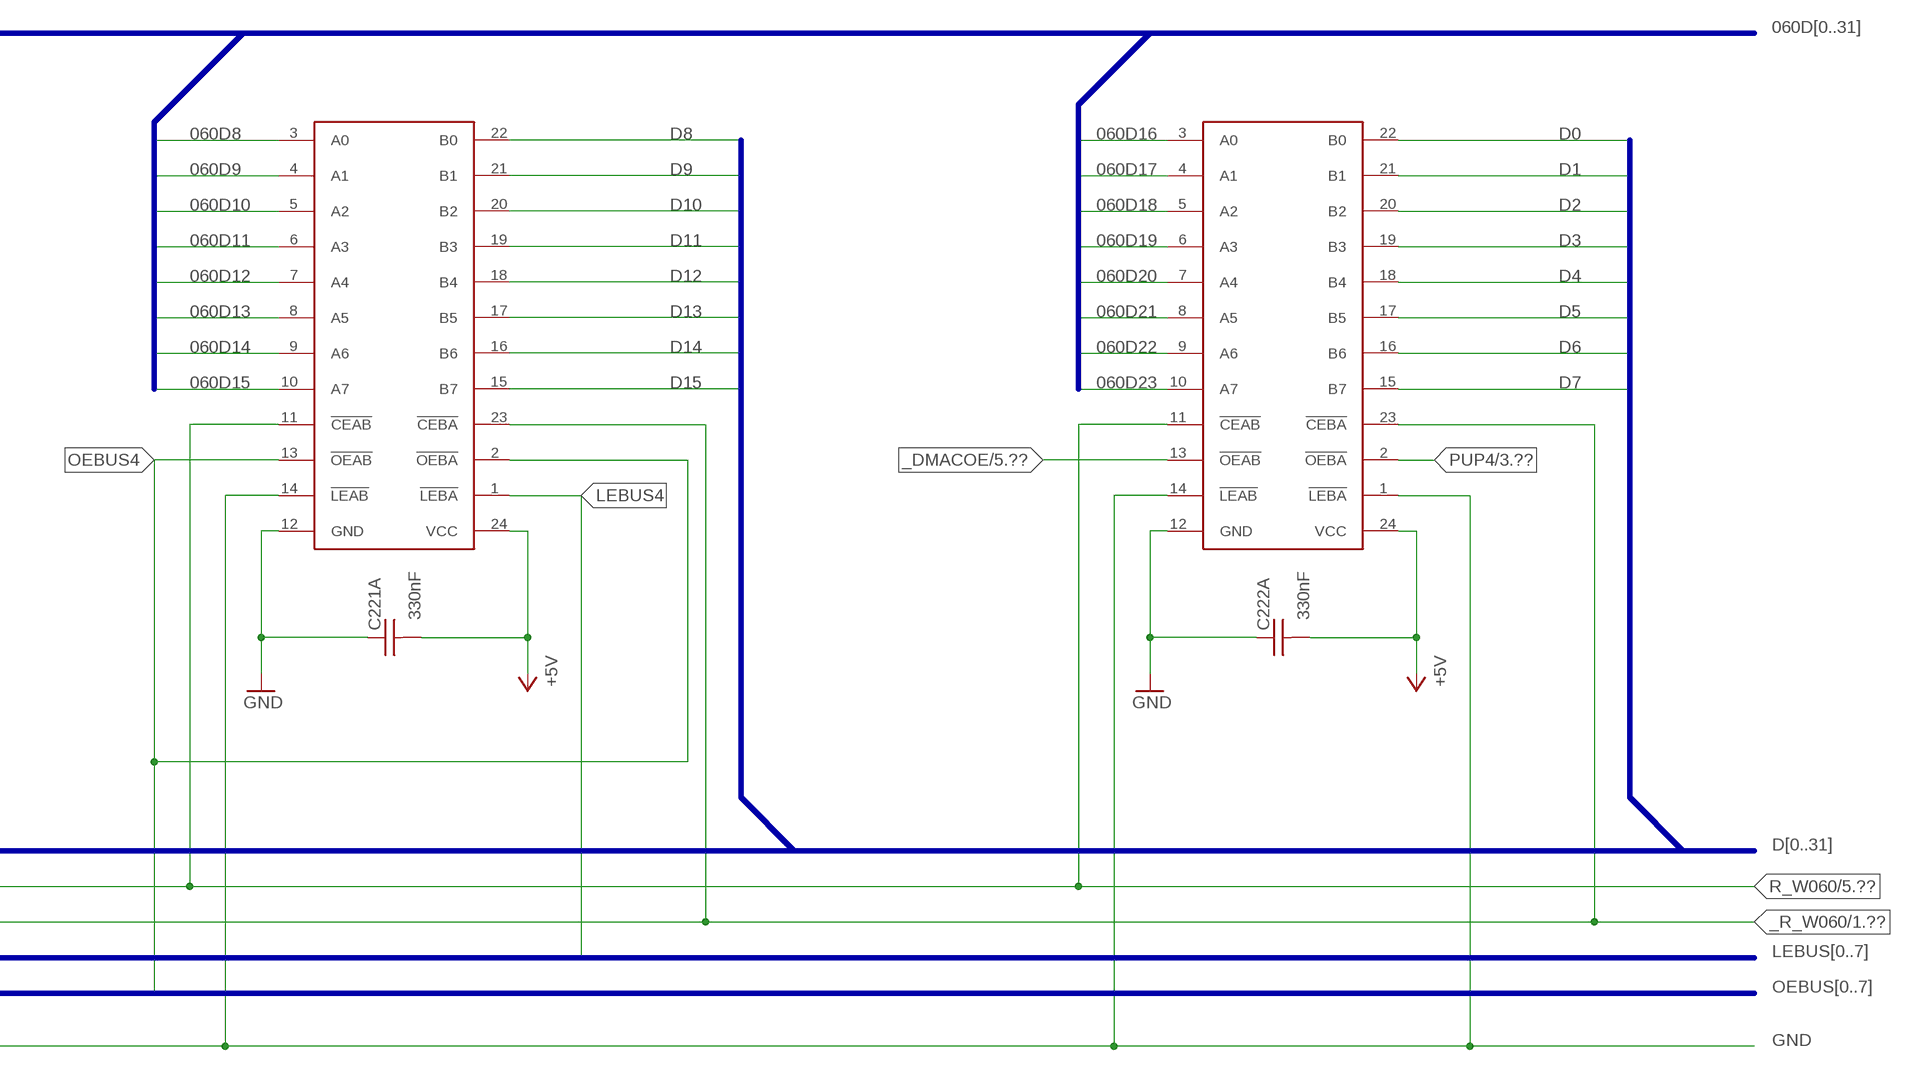
[diagram p8: schematic, sheet 4, part 4 of 4]

### Parts
C214A  330nF  C0805  [R0805]
C215A  330nF  C0805  [R0805]
C216A  330nF  C0805  [R0805]
C217A  330nF  C0805  [R0805]
C218A  330nF  C0805  [R0805]
C219A  330nF  C0805  [R0805]
C220A  330nF  C0805  [R0805]
C221A  330nF  C0805  [R0805]
C222A  330nF  C0805  [R0805]
U214  74FCT543A  [74FCT543A]
U215  74FCT543A  [74FCT543A]
U216  74FCT543A  [74FCT543A]
U217  74FCT543A  [74FCT543A]
U218  74FCT543A  [74FCT543A]
U219  74FCT543A  [74FCT543A]
U220  74FCT543A  [74FCT543A]
U221  74FCT543A  [74FCT543A]
U222  74FCT543A  [74FCT543A]

### Nets
060D0: U218.3(A0) U219.3(A0) U220.3(A0) ; also sheet 1,3
060D1: U218.4(A1) U219.4(A1) U220.4(A1) ; also sheet 1,3
060D2: U218.5(A2) U219.5(A2) U220.5(A2) ; also sheet 1,3
060D3: U218.6(A3) U219.6(A3) U220.6(A3) ; also sheet 1,3
060D4: U218.7(A4) U219.7(A4) U220.7(A4) ; also sheet 1,3
060D5: U218.8(A5) U219.8(A5) U220.8(A5) ; also sheet 1,3
060D6: U218.9(A6) U219.9(A6) U220.9(A6) ; also sheet 1,3
060D7: U218.10(A7) U219.10(A7) U220.10(A7) ; also sheet 1,3
060D8: U217.3(A0) U221.3(A0) ; also sheet 1,3
060D9: U217.4(A1) U221.4(A1) ; also sheet 1,3
060D10: U217.5(A2) U221.5(A2) ; also sheet 1,3
060D11: U217.6(A3) U221.6(A3) ; also sheet 1,3
060D12: U217.7(A4) U221.7(A4) ; also sheet 1,3
060D13: U217.8(A5) U221.8(A5) ; also sheet 1,3
060D14: U217.9(A6) U221.9(A6) ; also sheet 1,3
060D15: U217.10(A7) U221.10(A7) ; also sheet 1,3
060D16: U215.3(A0) U216.3(A0) U222.3(A0) ; also sheet 1,3
060D17: U215.4(A1) U216.4(A1) U222.4(A1) ; also sheet 1,3
060D18: U215.5(A2) U216.5(A2) U222.5(A2) ; also sheet 1,3
060D19: U215.6(A3) U216.6(A3) U222.6(A3) ; also sheet 1,3
060D20: U215.7(A4) U216.7(A4) U222.7(A4) ; also sheet 1,3
060D21: U215.8(A5) U216.8(A5) U222.8(A5) ; also sheet 1,3
060D22: U215.9(A6) U216.9(A6) U222.9(A6) ; also sheet 1,3
060D23: U215.10(A7) U216.10(A7) U222.10(A7) ; also sheet 1,3
060D24: U214.3(A0) ; also sheet 1,3
060D25: U214.4(A1) ; also sheet 1,3
060D26: U214.5(A2) ; also sheet 1,3
060D27: U214.6(A3) ; also sheet 1,3
060D28: U214.7(A4) ; also sheet 1,3
060D29: U214.8(A5) ; also sheet 1,3
060D30: U214.9(A6) ; also sheet 1,3
060D31: U214.10(A7) ; also sheet 1,3
+5V: C214A.2 C215A.2 C216A.2 C217A.2 C218A.2 C219A.2 C220A.2 C221A.2 C222A.2 U214.24(VCC) U215.24(VCC) U216.24(VCC) U217.24(VCC) U218.24(VCC) U219.24(VCC) U220.24(VCC) U221.24(VCC) U222.24(VCC) ; also sheet 1,2,3,5
_DMACOE: U222.13(!OEAB) ; also sheet 5
_R_W060: U214.23(!CEBA) U215.23(!CEBA) U216.23(!CEBA) U217.23(!CEBA) U218.23(!CEBA) U219.23(!CEBA) U220.23(!CEBA) U221.23(!CEBA) U222.23(!CEBA) ; also sheet 1
D0: U218.22(B0) U222.22(B0) ; also sheet 2
D1: U218.21(B1) U222.21(B1) ; also sheet 2
D2: U218.20(B2) U222.20(B2) ; also sheet 2
D3: U218.19(B3) U222.19(B3) ; also sheet 2
D4: U218.18(B4) U222.18(B4) ; also sheet 2
D5: U218.17(B5) U222.17(B5) ; also sheet 2
D6: U218.16(B6) U222.16(B6) ; also sheet 2
D7: U218.15(B7) U222.15(B7) ; also sheet 2
D8: U221.22(B0) ; also sheet 2
D9: U221.21(B1) ; also sheet 2
D10: U221.20(B2) ; also sheet 2
D11: U221.19(B3) ; also sheet 2
D12: U221.18(B4) ; also sheet 2
D13: U221.17(B5) ; also sheet 2
D14: U221.16(B6) ; also sheet 2
D15: U221.15(B7) ; also sheet 2
D16: U216.22(B0) U219.22(B0) ; also sheet 2
D17: U216.21(B1) U219.21(B1) ; also sheet 2
D18: U216.20(B2) U219.20(B2) ; also sheet 2
D19: U216.19(B3) U219.19(B3) ; also sheet 2
D20: U216.18(B4) U219.18(B4) ; also sheet 2
D21: U216.17(B5) U219.17(B5) ; also sheet 2
D22: U216.16(B6) U219.16(B6) ; also sheet 2
D23: U216.15(B7) U219.15(B7) ; also sheet 2
D24: U214.22(B0) U215.22(B0) U217.22(B0) U220.22(B0) ; also sheet 2
D25: U214.21(B1) U215.21(B1) U217.21(B1) U220.21(B1) ; also sheet 2
D26: U214.20(B2) U215.20(B2) U217.20(B2) U220.20(B2) ; also sheet 2
D27: U214.19(B3) U215.19(B3) U217.19(B3) U220.19(B3) ; also sheet 2
D28: U214.18(B4) U215.18(B4) U217.18(B4) U220.18(B4) ; also sheet 2
D29: U214.17(B5) U215.17(B5) U217.17(B5) U220.17(B5) ; also sheet 2
D30: U214.16(B6) U215.16(B6) U217.16(B6) U220.16(B6) ; also sheet 2
D31: U214.15(B7) U215.15(B7) U217.15(B7) U220.15(B7) ; also sheet 2
GND: C214A.1 C215A.1 C216A.1 C217A.1 C218A.1 C219A.1 C220A.1 C221A.1 C222A.1 U214.12(GND) U214.14(!LEAB) U215.12(GND) U215.14(!LEAB) U216.12(GND) U216.14(!LEAB) U217.12(GND) U217.14(!LEAB) U218.12(GND) U218.14(!LEAB) U219.12(GND) U219.14(!LEAB) U220.12(GND) U220.14(!LEAB) U221.12(GND) U221.14(!LEAB) U222.1(!LEBA) U222.12(GND) U222.14(!LEAB) ; also sheet 1,2,3,5
LEBUS0: U214.1(!LEBA) ; also sheet 5
LEBUS1: U215.1(!LEBA) ; also sheet 5
LEBUS2: U216.1(!LEBA) ; also sheet 5
LEBUS3: U217.1(!LEBA) ; also sheet 5
LEBUS4: U221.1(!LEBA) ; also sheet 5
LEBUS5: U220.1(!LEBA) ; also sheet 5
LEBUS6: U219.1(!LEBA) ; also sheet 5
LEBUS7: U218.1(!LEBA) ; also sheet 5
OEBUS0: U214.2(!OEBA) U214.13(!OEAB) ; also sheet 5
OEBUS1: U215.2(!OEBA) U215.13(!OEAB) ; also sheet 5
OEBUS2: U216.2(!OEBA) U216.13(!OEAB) ; also sheet 5
OEBUS3: U217.2(!OEBA) U217.13(!OEAB) ; also sheet 5
OEBUS4: U221.2(!OEBA) U221.13(!OEAB) ; also sheet 5
OEBUS5: U220.2(!OEBA) U220.13(!OEAB) ; also sheet 5
OEBUS6: U219.2(!OEBA) U219.13(!OEAB) ; also sheet 5
OEBUS7: U218.2(!OEBA) U218.13(!OEAB) ; also sheet 5
PUP4: U222.2(!OEBA) ; also sheet 3
R_W060: U214.11(!CEAB) U215.11(!CEAB) U216.11(!CEAB) U217.11(!CEAB) U218.11(!CEAB) U219.11(!CEAB) U220.11(!CEAB) U221.11(!CEAB) U222.11(!CEAB) ; also sheet 1,3,5

### Buses
060D[0..31]
LEBUS[0..7]
OEBUS[0..7]
D[0..31]

## Sheet 5 of 6: Logic
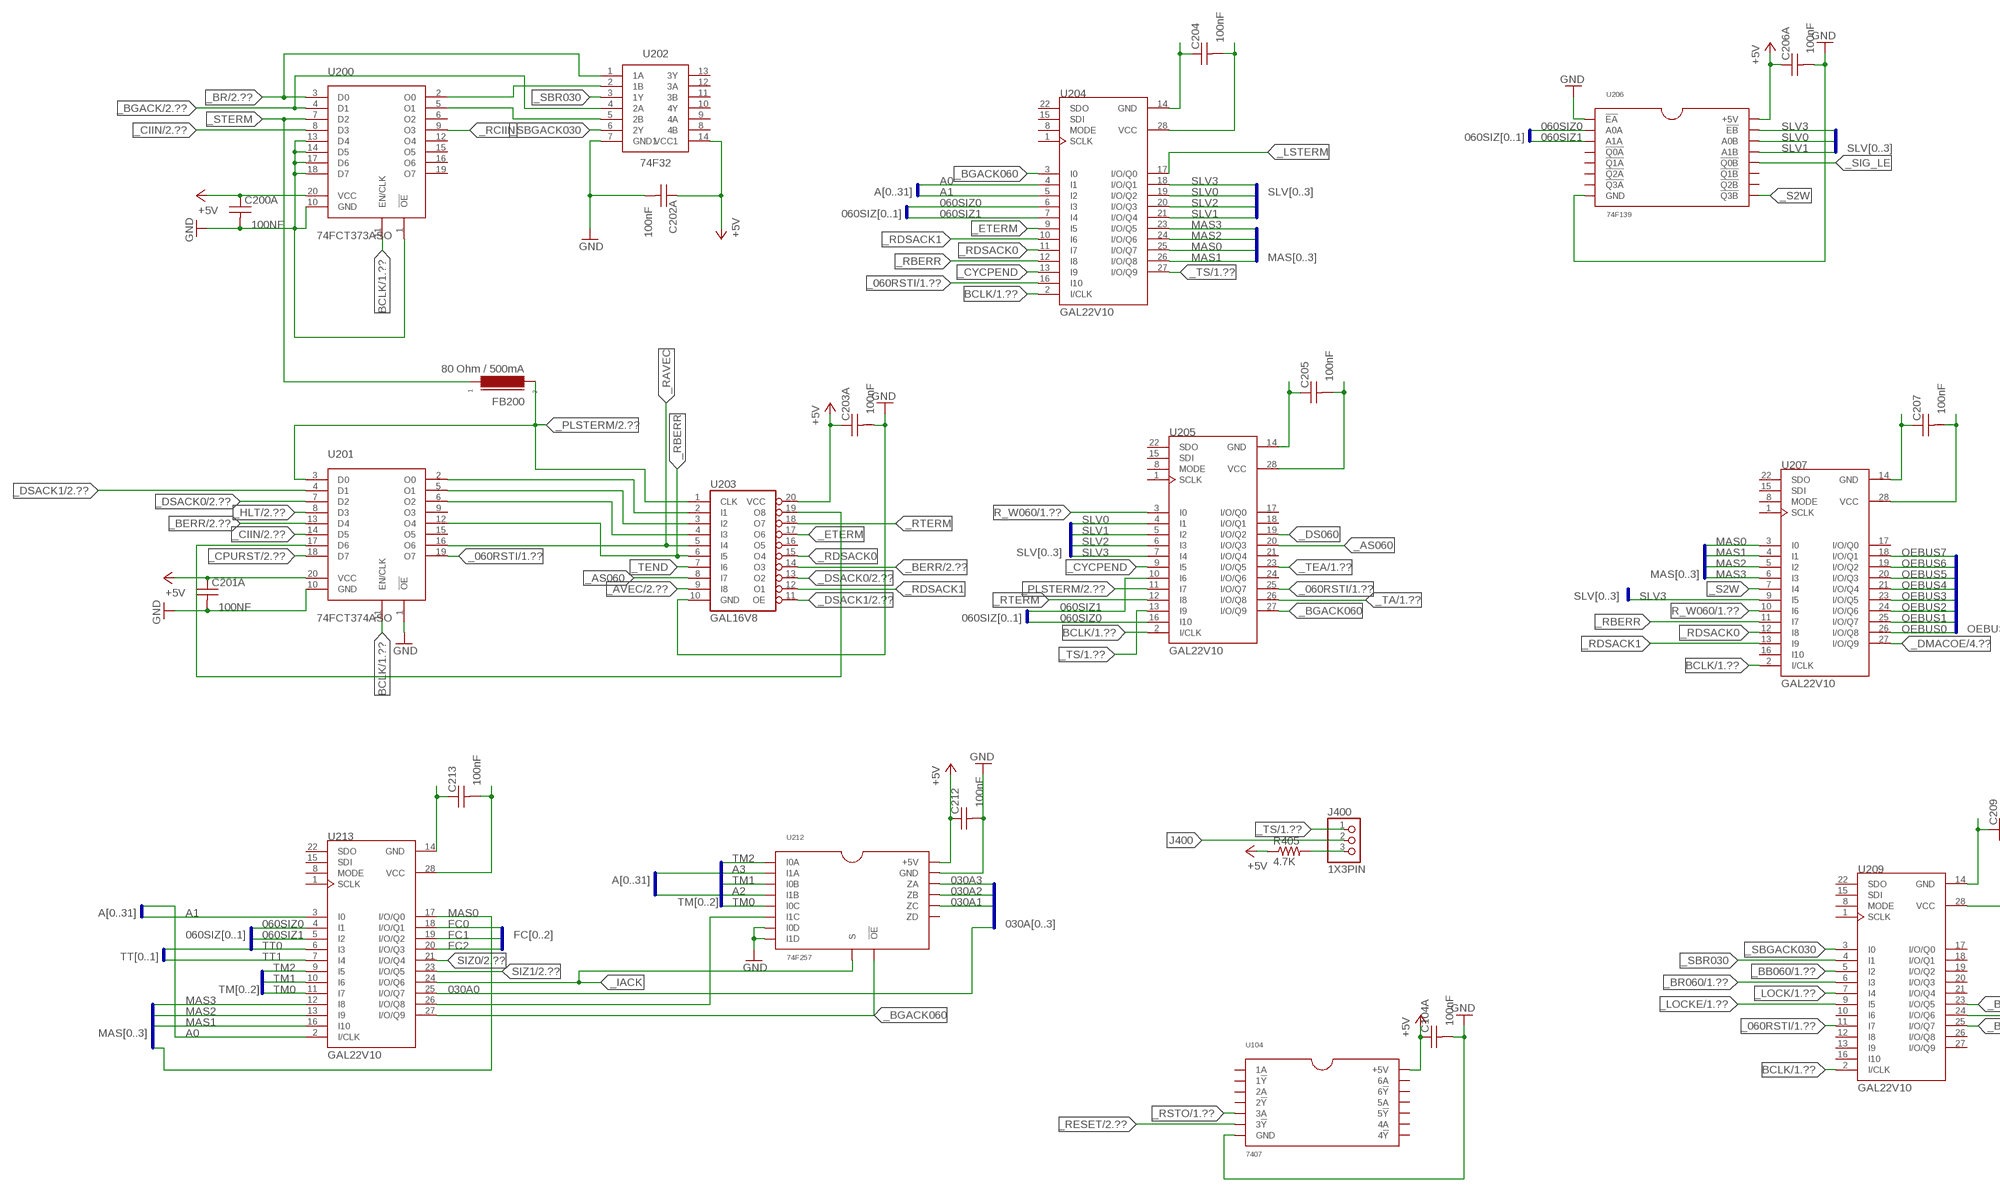
[diagram p9: schematic, sheet 5, part 1 of 2]
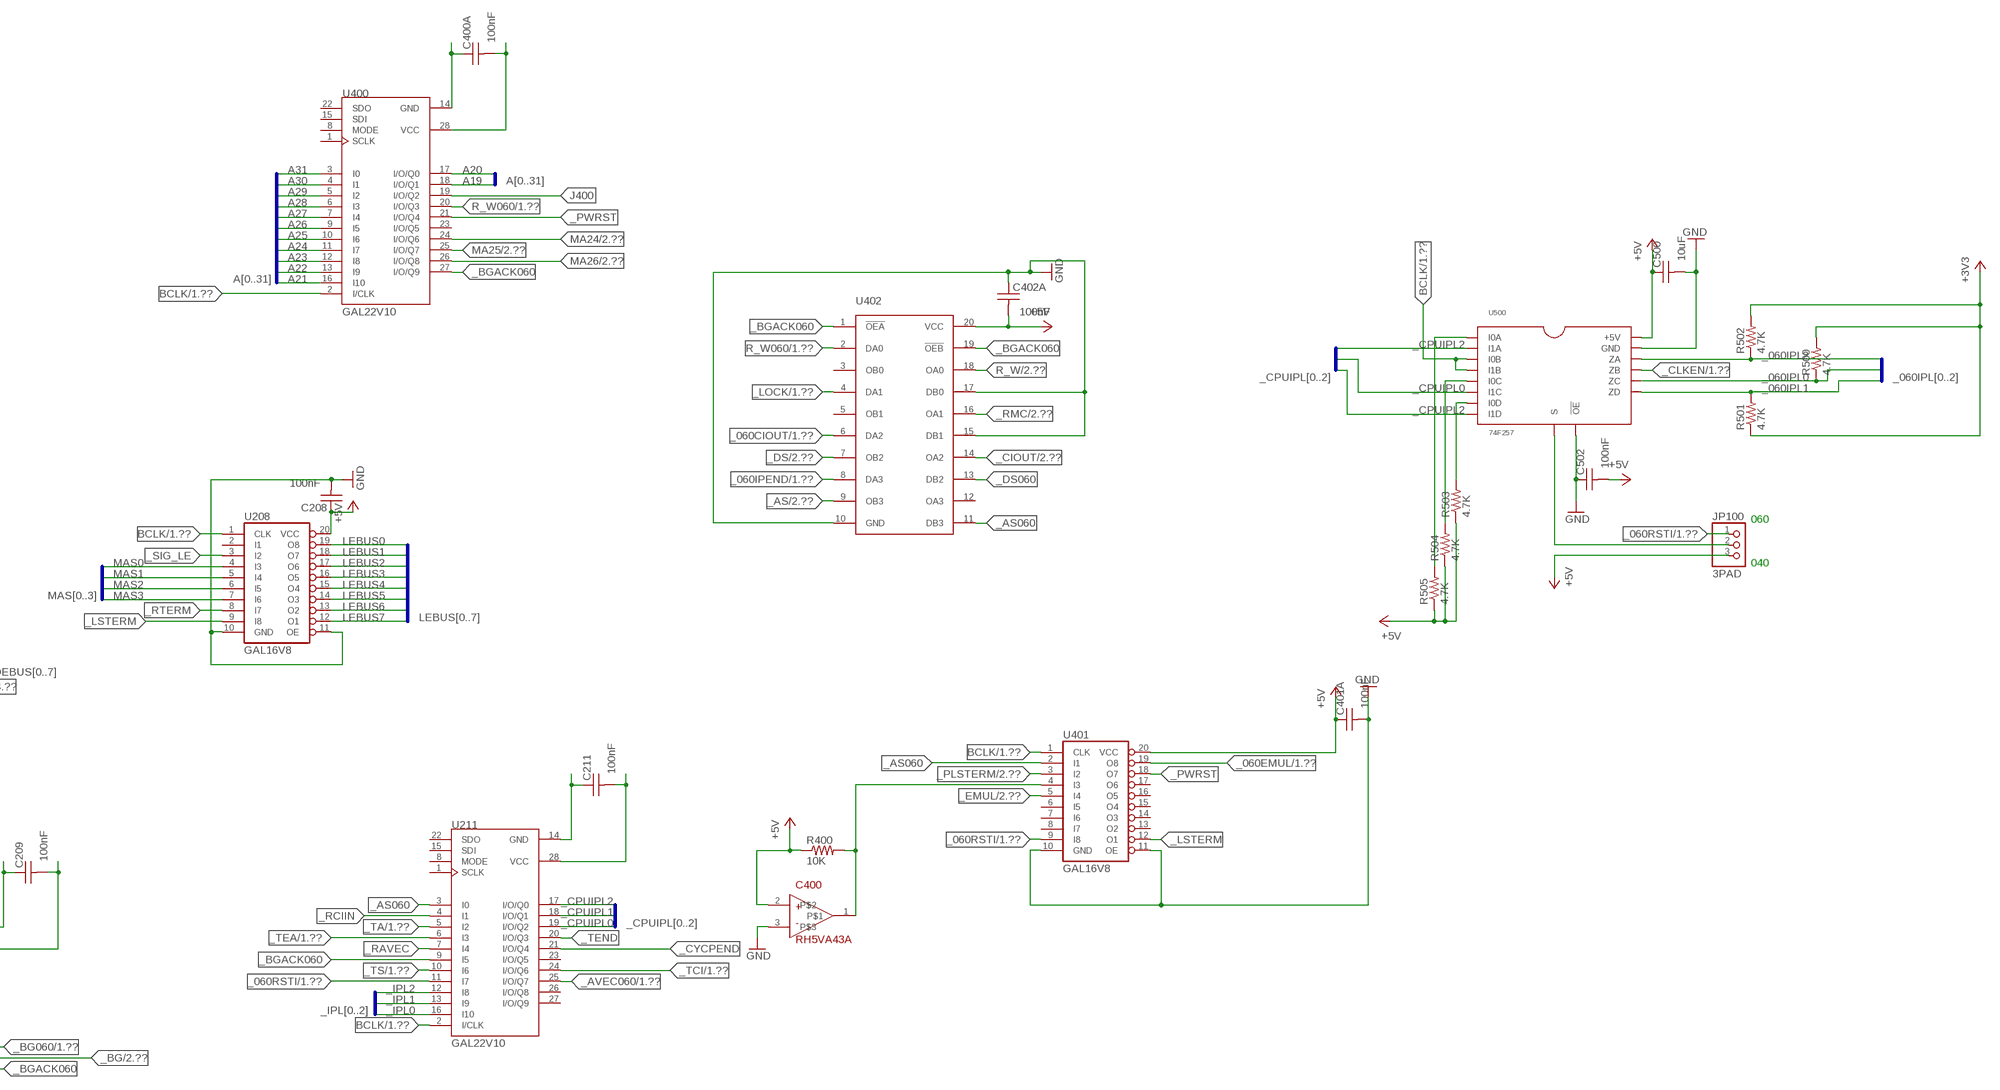
[diagram p10: schematic, sheet 5, part 2 of 2]

### Parts
C104A  100nF  C0805  [R0805]
C200A  100NF  C0805  [R0805]
C201A  100NF  C0805  [R0805]
C202A  100nF  C0805  [R0805]
C203A  100nF  C0805  [R0805]
C204  100nF  C0805  [R0805]
C205  100nF  C0805  [R0805]
C206A  100nF  C0805  [R0805]
C207  100nF  C0805  [R0805]
C208  100nF  C0805  [R0805]
C209  100nF  C0805  [R0805]
C211  100nF  C0805  [R0805]
C212  100nF  C0805  [R0805]
C213  100nF  C0805  [R0805]
C400  RH5VA43A  [RH5VA43A]
C400A  100nF  C0805  [R0805]
C401A  100nF  C0805  [R0805]
C402A  100nF  C0805  [R0805]
C500  10uF  C0805  [R0805]
C502  100nF  C0805  [R0805]
FB200  80 Ohm / 500mA  FERRITE  [FERRITE]
J400  1X3PIN  [1X3PIN]
JP100  3PAD  [3PAD]
R400  10K  R0805  [R0805]
R405  4.7K  R0805  [R0805]
R500  4.7K  R0805  [R0805]
R501  4.7K  R0805  [R0805]
R502  4.7K  R0805  [R0805]
R503  4.7K  R0805  [R0805]
R504  4.7K  R0805  [R0805]
R505  4.7K  R0805  [R0805]
U104  7407  [7407]
U200  74FCT373ASO  [74FCT373ASO]
U201  74FCT374ASO  [74FCT374ASO]
U202  74F32  [74F32]
U203  GAL16V8  [GAL16V8]
U204  GAL22V10  [GAL22V10]
U205  GAL22V10  [GAL22V10]
U206  74F139  [74F139]
U207  GAL22V10  [GAL22V10]
U208  GAL16V8  [GAL16V8]
U209  GAL22V10  [GAL22V10]
U211  GAL22V10  [GAL22V10]
U212  74F257  [74F257]
U213  GAL22V10  [GAL22V10]
U400  GAL22V10  [GAL22V10]
U401  GAL16V8  [GAL16V8]
U402  74FCT244A  [74FCT244A]
U500  74F257  [74F257]

### Nets
030A0: U213.25(I/O/Q7) ; also sheet 2
030A1: U212.12(ZC) ; also sheet 2
030A2: U212.7(ZB) ; also sheet 2
030A3: U212.4(ZA) ; also sheet 2
060SIZ0: U204.6(I3) U205.16(I10) U206.2(A0A) U213.4(I1) ; also sheet 1,3
060SIZ1: U204.7(I4) U205.10(I6) U206.3(A1A) U213.5(I2) ; also sheet 1,3
+3V3: R500.2 R501.1 R502.2 ; also sheet 1,3
+5V: C104A.1 C200A.1 C201A.1 C202A.1 C203A.1 C206A.1 C208.1 C212.1 C400.2 C401A.1 C402A.2 C500.1 C502.2 JP100.3 R400.1 R405.1 R503.1 R504.1 R505.1 U104.VCC(+5V) U200.20(VCC) U201.20(VCC) U202.14(VCC1) U203.20(VCC) U206.16(+5V) U208.20(VCC) U212.16(+5V) U401.20(VCC) U402.20(VCC) U500.16(+5V) ; also sheet 1,2,3,4
_060CIOUT: U402.6(DA2) ; also sheet 1,3
_060EMUL: U401.19(O8) ; also sheet 1
_060IPEND: U402.8(DA3) ; also sheet 1
_060IPL0: R500.1 U500.12(ZC) ; also sheet 1
_060IPL1: R501.2 U500.9(ZD) ; also sheet 1
_060IPL2: R502.1 U500.4(ZA) ; also sheet 1
_060RSTI: JP100.1 U201.19(O7) U204.16(I10) U205.25(I/O/Q7) U209.11(I7) U211.11(I7) U401.9(I8) ; also sheet 1
_AS: U402.9(OB3) ; also sheet 2
_AS060: U203.8(I7) U205.20(I/O/Q3) U211.3(I0) U401.2(I1) U402.11(DB3)
_AVEC: U203.9(I8) ; also sheet 2
_AVEC060: U211.25(I/O/Q7) ; also sheet 1
_BB060: U209.5(I2) ; also sheet 1,3
_BERR: U201.13(D4) U203.14(O3) ; also sheet 2
_BG: U209.24(I/O/Q6) ; also sheet 2
_BG060: U209.23(I/O/Q5) ; also sheet 1
_BGACK: U200.4(D1) U202.4(2A) ; also sheet 2
_BGACK060: U204.3(I0) U205.27(I/O/Q9) U209.25(I/O/Q7) U211.9(I5) U212.15(!OE) U213.27(I/O/Q9) U400.27(I/O/Q9) U402.1(!OEA) U402.19(!OEB)
_BR: U200.3(D0) U202.1(1A) ; also sheet 2
_BR060: U209.6(I3) ; also sheet 1
_CIIN: U200.8(D3) U201.14(D5) ; also sheet 2
_CIOUT: U402.14(OA2) ; also sheet 2
_CLKEN: U500.7(ZB) ; also sheet 1
_CPUIPL0: U211.19(I/O/Q2) U500.13(I1C)
_CPUIPL1: U211.18(I/O/Q1)
_CPUIPL2: U211.17(I/O/Q0) U500.3(I1A) U500.10(I1D)
_CPURST: U201.18(D7) ; also sheet 2
_CYCPEND: U204.13(I9) U205.9(I5) U211.21(I/O/Q4)
_DMACOE: U207.27(I/O/Q9) ; also sheet 4
_DS: U402.7(OB2) ; also sheet 2
_DS060: U205.19(I/O/Q2) U402.13(DB2)
_DSACK0: U201.7(D2) U203.13(O2) ; also sheet 2
_DSACK1: U201.4(D1) U203.11(OE) ; also sheet 2
_EMUL: U401.5(I4) ; also sheet 2
_ETERM: U203.17(O6) U204.9(I5)
_HLT: U201.8(D3) ; also sheet 2
_IACK: U212.1(S) U213.24(I/O/Q6)
_IPL0: U211.16(I10) ; also sheet 2
_IPL1: U211.13(I9) ; also sheet 2
_IPL2: U211.12(I8) ; also sheet 2
_LOCK: U209.7(I4) U402.4(DA1) ; also sheet 1,3
_LOCKE: U209.9(I5) ; also sheet 1,3
_LSTERM: U204.17(I/O/Q0) U208.9(I8) U401.12(O1)
_PLSTERM: FB200.2 U201.3(D0) U203.1(CLK) U205.11(I7) U401.3(I2) ; also sheet 2
_PWRST: U400.21(I/O/Q4) U401.18(O7)
_RAVEC: U201.16(O6) U203.5(I4) U211.7(I4)
_RBERR: U201.12(O4) U203.6(I5) U204.12(I8) U207.11(I7)
_RCIIN: U200.9(O3) U211.4(I1)
_RDSACK0: U203.15(O4) U204.11(I7) U207.12(I8)
_RDSACK1: U203.12(O1) U204.10(I6) U207.13(I9)
_RESET: U104.5(3!Y) ; also sheet 2
_RMC: U402.16(OA1) ; also sheet 2
_RSTO: U104.6(3A) ; also sheet 1
_RTERM: U203.18(O7) U205.12(I8) U208.8(I7)
_S2W: U206.9(!Q3B) U207.7(I4)
_SBGACK030: U202.6(2Y) U209.3(I0)
_SBR030: U202.3(1Y) U209.4(I1)
_SIG_LE: U206.12(!Q0B) U208.3(I2)
_STERM: FB200.1 U200.7(D2)
_TA: U205.26(I/O/Q8) U211.5(I2) ; also sheet 1
_TCI: U211.24(I/O/Q6) ; also sheet 1
_TEA: U205.23(I/O/Q5) U211.6(I3) ; also sheet 1
_TEND: U203.7(I6) U211.20(I/O/Q3)
_TS: J400.1 U204.27(I/O/Q9) U205.13(I9) U211.10(I6) ; also sheet 1
A0: U204.4(I1) U213.2(I/CLK) ; also sheet 3
A1: U204.5(I2) U213.3(I0) ; also sheet 3
A2: U212.6(I1B) ; also sheet 3
A3: U212.3(I1A) ; also sheet 3
A19: U400.18(I/O/Q1) ; also sheet 2,3
A20: U400.17(I/O/Q0) ; also sheet 2,3
A21: U400.16(I10) ; also sheet 2,3
A22: U400.13(I9) ; also sheet 2,3
A23: U400.12(I8) ; also sheet 2,3
A24: U400.11(I7) ; also sheet 3
A25: U400.10(I6) ; also sheet 3
A26: U400.9(I5) ; also sheet 3
A27: U400.7(I4) ; also sheet 2,3
A28: U400.6(I3) ; also sheet 2,3
A29: U400.5(I2) ; also sheet 2,3
A30: U400.4(I1) ; also sheet 2,3
A31: U400.3(I0) ; also sheet 2,3
BCLK: U200.11(EN/CLK) U201.11(EN/CLK) U204.2(I/CLK) U205.2(I/CLK) U207.2(I/CLK) U208.1(CLK) U209.2(I/CLK) U211.2(I/CLK) U400.2(I/CLK) U401.1(CLK) U500.5(I0B) U500.6(I1B) ; also sheet 1
CPUSEL: JP100.2 U500.1(S)
FC0: U213.18(I/O/Q1) ; also sheet 2
FC1: U213.19(I/O/Q2) ; also sheet 2
FC2: U213.20(I/O/Q3) ; also sheet 2
GND: C104A.2 C200A.2 C201A.2 C202A.2 C203A.2 C206A.2 C208.2 C212.2 C400.3 C401A.2 C402A.1 C500.2 C502.1 U104.GND U200.1(!OE) U200.10(GND) U200.13(D4) U200.14(D5) U200.17(D6) U200.18(D7) U201.1(!OE) U201.10(GND) U202.7(GND1) U203.10(GND) U206.1(!EA) U206.8(GND) U208.10(GND) U208.11(OE) U212.8(GND) U212.10(I1D) U212.11(I0D) U401.10(GND) U401.11(OE) U402.10(GND) U402.15(DB1) U402.17(DB0) U500.8(GND) U500.15(!OE) ; also sheet 1,2,3,4
J400: J400.2 U400.19(I/O/Q2)
LEBUS0: U208.19(O8) ; also sheet 4
LEBUS1: U208.18(O7) ; also sheet 4
LEBUS2: U208.17(O6) ; also sheet 4
LEBUS3: U208.16(O5) ; also sheet 4
LEBUS4: U208.15(O4) ; also sheet 4
LEBUS5: U208.14(O3) ; also sheet 4
LEBUS6: U208.13(O2) ; also sheet 4
LEBUS7: U208.12(O1) ; also sheet 4
MA24: U400.24(I/O/Q6) ; also sheet 2
MA25: U400.25(I/O/Q7) ; also sheet 2
MA26: U400.26(I/O/Q8) ; also sheet 2
MAS0: U204.25(I/O/Q7) U207.3(I0) U208.4(I3) U213.17(I/O/Q0)
MAS1: U204.26(I/O/Q8) U207.4(I1) U208.5(I4) U213.16(I10)
MAS2: U204.24(I/O/Q6) U207.5(I2) U208.6(I5) U213.13(I9)
MAS3: U204.23(I/O/Q5) U207.6(I3) U208.7(I6) U213.12(I8)
N$1: C400.1 R400.2 U401.4(I3)
N$18: U201.17(D6) U203.19(O8)
N$19: J400.3 R405.2
N$20: R503.2 U500.11(I0D)
N$21: R504.2 U500.14(I0C)
N$22: U200.2(O0) U202.2(1B)
N$23: U200.5(O1) U202.5(2B)
N$24: U201.2(O0) U203.2(I1)
N$25: U201.5(O1) U203.3(I2)
N$26: U201.6(O2) U203.4(I3)
N$27: C204.1 U204.14(GND)
N$28: C204.2 U204.28(VCC)
N$29: C207.1 U207.14(GND)
N$30: C207.2 U207.28(VCC)
N$31: C213.1 U213.14(GND)
N$32: C213.2 U213.28(VCC)
N$33: U212.13(I1C) U213.26(I/O/Q8)
N$34: C209.1 U209.14(GND)
N$35: C209.2 U209.28(VCC)
N$36: C211.1 U211.14(GND)
N$37: C211.2 U211.28(VCC)
N$38: C400A.1 U400.14(GND)
N$39: C400A.2 U400.28(VCC)
N$40: R505.2 U500.2(I0A)
N$43: C205.1 U205.14(GND)
N$44: C205.2 U205.28(VCC)
OEBUS0: U207.26(I/O/Q8) ; also sheet 4
OEBUS1: U207.25(I/O/Q7) ; also sheet 4
OEBUS2: U207.24(I/O/Q6) ; also sheet 4
OEBUS3: U207.23(I/O/Q5) ; also sheet 4
OEBUS4: U207.21(I/O/Q4) ; also sheet 4
OEBUS5: U207.20(I/O/Q3) ; also sheet 4
OEBUS6: U207.19(I/O/Q2) ; also sheet 4
OEBUS7: U207.18(I/O/Q1) ; also sheet 4
R_W: U402.18(OA0) ; also sheet 2
R_W060: U205.3(I0) U207.10(I6) U400.20(I/O/Q3) U402.2(DA0) ; also sheet 1,3,4
SIZ0: U213.21(I/O/Q4) ; also sheet 2
SIZ1: U213.23(I/O/Q5) ; also sheet 2
SLV0: U204.19(I/O/Q2) U205.4(I1) U206.14(A0B)
SLV1: U204.21(I/O/Q4) U205.5(I2) U206.13(A1B)
SLV2: U204.20(I/O/Q3) U205.6(I3)
SLV3: U204.18(I/O/Q1) U205.7(I4) U206.15(!EB) U207.9(I5)
TM0: U212.14(I0C) U213.11(I7) ; also sheet 1,3
TM1: U212.5(I0B) U213.10(I6) ; also sheet 1,3
TM2: U212.2(I0A) U213.9(I5) ; also sheet 1,3
TT0: U213.6(I3) ; also sheet 1,3
TT1: U213.7(I4) ; also sheet 1,3
Unconnected: U104.1(1!Y) U104.2(1A) U104.3(2!Y) U104.4(2A) U104.8(4!Y) U104.9(4A) U104.10(5!Y) U104.11(5A) U104.12(6!Y) U104.13(6A) U200.6(O2) U200.12(O4) U200.15(O5) U200.16(O6) U200.19(O7) U201.9(O3) U201.15(O5) U202.8(4B) U202.9(4A) U202.10(4Y) U202.11(3B) U202.12(3A) U202.13(3Y) U203.16(O5) U204.1(SCLK) U204.8(MODE) U204.15(SDI) U204.22(SDO) U205.1(SCLK) U205.8(MODE) U205.15(SDI) U205.17(I/O/Q0) U205.18(I/O/Q1) U205.21(I/O/Q4) U205.22(SDO) U205.24(I/O/Q6) U206.4(!Q0A) U206.5(!Q1A) U206.6(!Q2A) U206.7(!Q3A) U206.10(!Q2B) U206.11(!Q1B) U207.1(SCLK) U207.8(MODE) U207.15(SDI) U207.16(I10) U207.17(I/O/Q0) U207.22(SDO) U208.2(I1) U209.1(SCLK) U209.8(MODE) U209.10(I6) U209.12(I8) U209.13(I9) U209.15(SDI) U209.16(I10) U209.17(I/O/Q0) U209.18(I/O/Q1) U209.19(I/O/Q2) U209.20(I/O/Q3) U209.21(I/O/Q4) U209.22(SDO) U209.26(I/O/Q8) U209.27(I/O/Q9) U211.1(SCLK) U211.8(MODE) U211.15(SDI) U211.22(SDO) U211.23(I/O/Q5) U211.26(I/O/Q8) U211.27(I/O/Q9) U212.9(ZD) U213.1(SCLK) U213.8(MODE) U213.15(SDI) U213.22(SDO) U400.1(SCLK) U400.8(MODE) U400.15(SDI) U400.22(SDO) U400.23(I/O/Q5) U401.6(I5) U401.7(I6) U401.8(I7) U401.13(O2) U401.14(O3) U401.15(O4) U401.16(O5) U401.17(O6) U402.3(OB0) U402.5(OB1) U402.12(OA3)

### Buses
A[0..31]
060SIZ[0..1]
MAS[0..3]
SLV[0..3]
OEBUS[0..7]
LEBUS[0..7]
TT[0..1]
TM[0..2]
FC[0..2]
030A[0..3]
_IPL[0..2]
_CPUIPL[0..2]
_060IPL[0..2]

### Notes on the sheet
- 060
- 040

## Sheet 6 of 6

## Library data of the parts
+5V U$2 = A3660:1X2PIN
C100A C101A C101B C102A C102C C102D C102F C103A C104A C105A C200A C201A C202A C203A C204 C205 C206A C207-C209 C211-C213 C214A C215A C216A C217A C218A C219A C220A C221A C222A C400A C401A C402A C500-C502 = A3660:C0805
C102B C102E C105-C107 = A3660:SMD-ELECTROLYTE
C400 = A3660:RH5VA43A
CN100 = A3660:KEL8817-200-170S-F: Original design by Edu Arana Pinout corrected and signals added by John Hertell
FB100 FB200 = A3660:FERRITE
J400 = A3660:1X3PIN
JP100 = A3660:3PAD
R100 R100A R101A R101B R102-R105 R107 R108 R400-R405 R500-R505 = A3660:R0805
RP1 RP100A RP101-RP108 RP400A RP400B RP401A RP401B RP402A RP402B RP403A RP403B RP404A RP404B RP405A RP405B RP405C = A3660:RP743-8
U100 = A3660:OSCILLATOR
U101 = A3660:74F1803
U102 = A3660:MC68040/68060: Motorola 68040 or 68060 32 Bit CPU by John Hertell
U103 = A3660:DELAYLINE
U104 = A3660:7407
U105 = A3660:74F04
U200 = A3660:74FCT373ASO
U201 = A3660:74FCT374ASO
U202 = A3660:74F32
U203 U208 U401 = A3660:GAL16V8: By Edu Arana
U204 U205 U207 U209 U211 U213 U400 = A3660:GAL22V10: Device made by Edu Arana
U206 = A3660:74F139
U212 U500 = A3660:74F257
U214-U222 = A3660:74FCT543A: By Edu Arana
U402 = A3660:74FCT244A
U$1 = adafruit:2X22
VR1 = A3660:LT1084-3.3

## Net classes
0 default: width 0.127 mm, clearance 0.127 mm